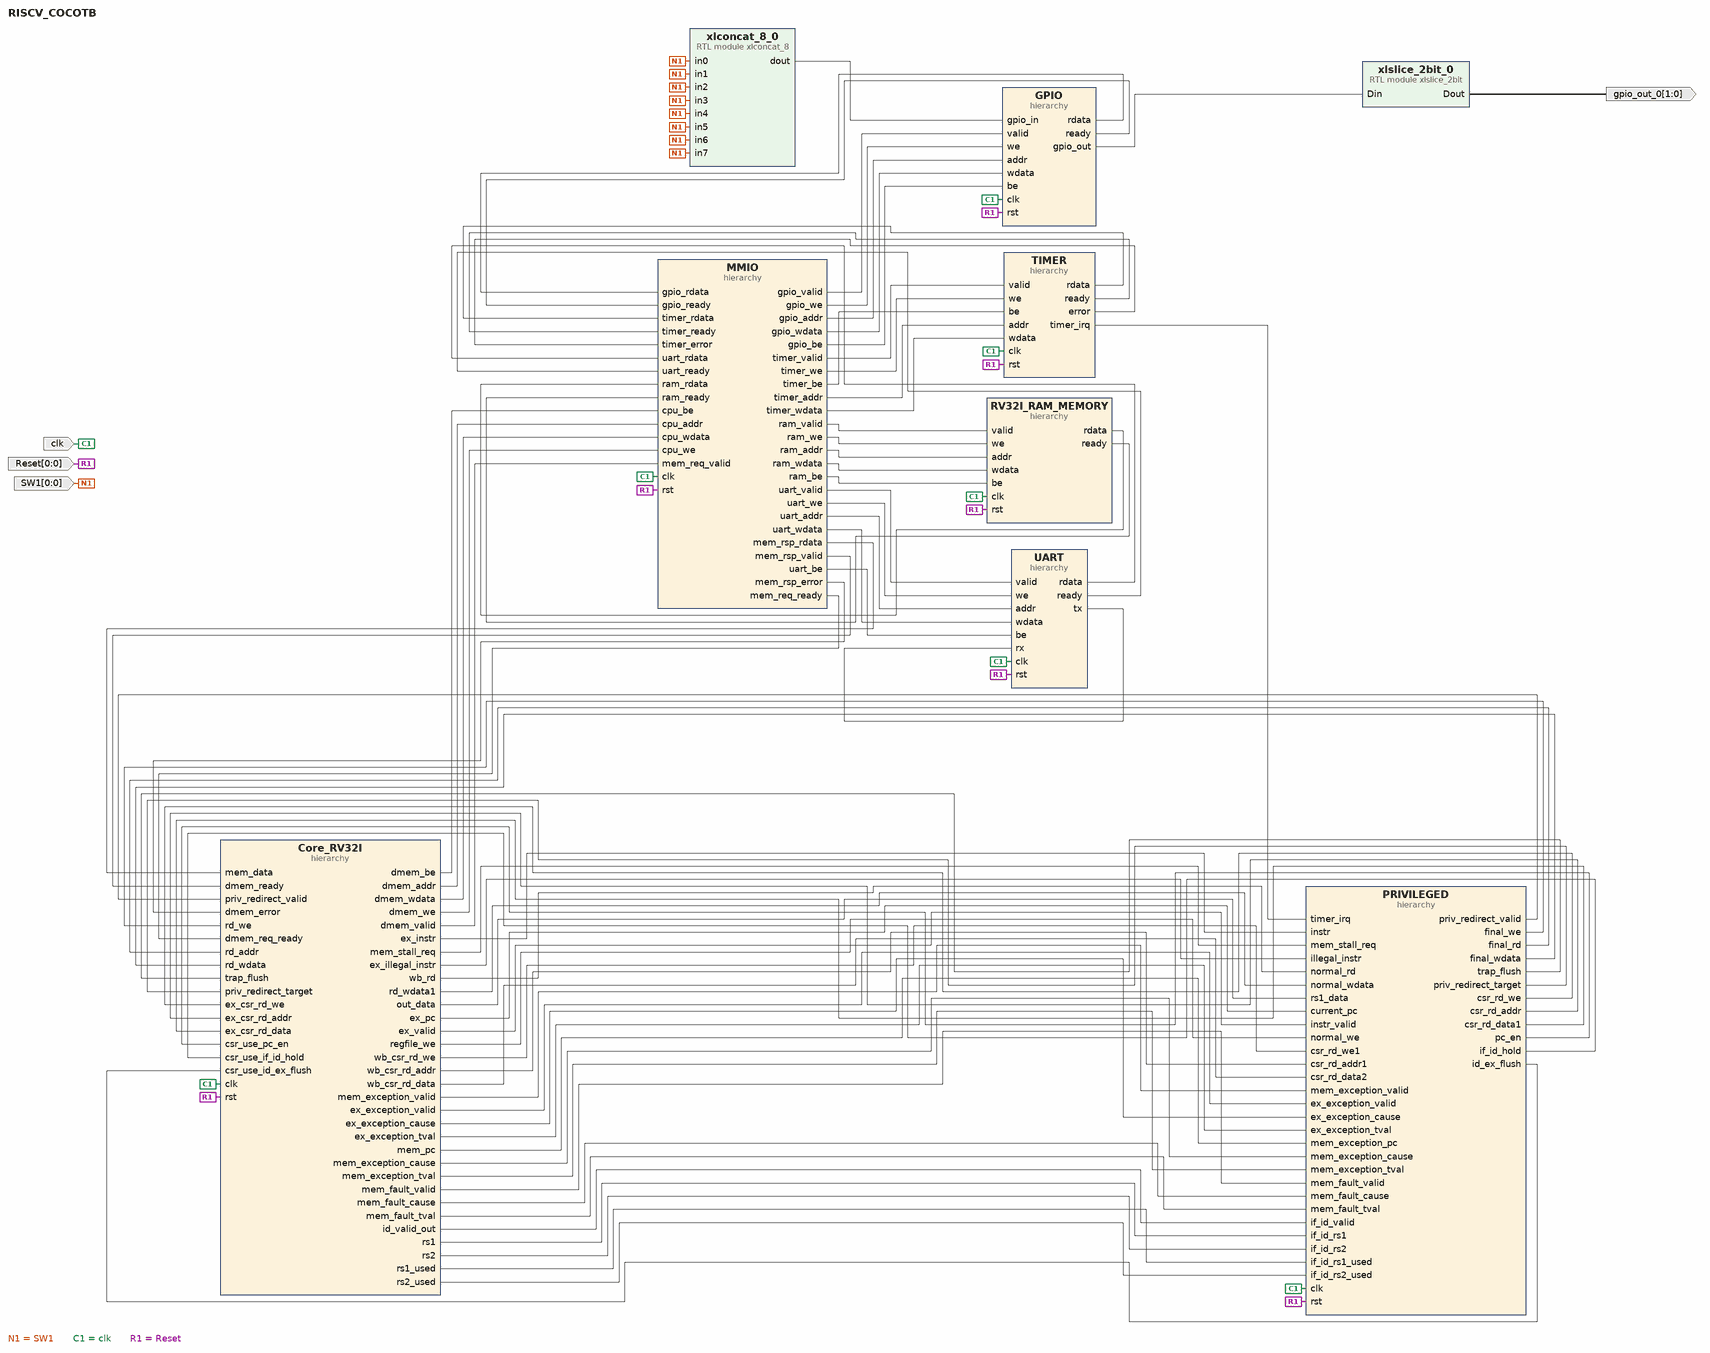
[diagram p0: block diagram of the top level]
# Vivado block design RISCV_COCOTB, xczu5ev-sfvc784-2-i, Vivado 2020.1
create_bd_design RISCV_COCOTB

create_bd_port -dir I -from 0 -to 0 SW1
create_bd_port -dir O -from 1 -to 0 gpio_out_0
create_bd_port -dir I -from 0 -to 0 Reset
create_bd_port -dir I clk

create_bd_cell -type hier UART
create_bd_cell -type hier TIMER
create_bd_cell -type hier Core_RV32I
create_bd_cell -type hier MMIO
create_bd_cell -type hier PRIVILEGED
create_bd_cell -type hier GPIO
create_bd_cell -type hier RV32I_RAM_MEMORY
create_bd_cell -type module -reference xlconcat_8 xlconcat_8_0
create_bd_cell -type module -reference xlslice_2bit xlslice_2bit_0

# ---- hierarchy /UART ----
current_bd_instance /UART
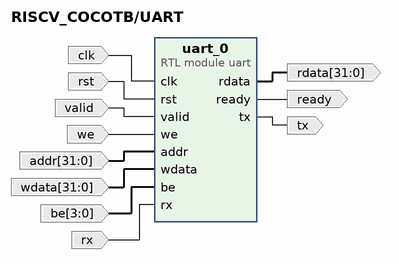
[diagram p1: block diagram inside /UART]
create_bd_pin -dir I -type clk clk
create_bd_pin -dir I -type rst rst
create_bd_pin -dir I valid
create_bd_pin -dir I we
create_bd_pin -dir I -from 31 -to 0 addr
create_bd_pin -dir I -from 31 -to 0 wdata
create_bd_pin -dir I -from 3 -to 0 be
create_bd_pin -dir O -from 31 -to 0 rdata
create_bd_pin -dir O ready
create_bd_pin -dir O tx
create_bd_pin -dir I rx

create_bd_cell -type module -reference uart uart_0

# ---- hierarchy /TIMER ----
current_bd_instance /TIMER
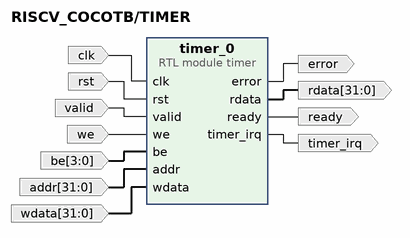
[diagram p2: block diagram inside /TIMER]
create_bd_pin -dir I -type clk clk
create_bd_pin -dir I -type rst rst
create_bd_pin -dir I valid
create_bd_pin -dir I we
create_bd_pin -dir I -from 3 -to 0 be
create_bd_pin -dir I -from 31 -to 0 addr
create_bd_pin -dir I -from 31 -to 0 wdata
create_bd_pin -dir O -from 31 -to 0 rdata
create_bd_pin -dir O ready
create_bd_pin -dir O -type intr timer_irq
create_bd_pin -dir O error

create_bd_cell -type module -reference timer timer_0
set_property -dict {CONFIG.RESET_CMP 0x0002E7CA} [get_bd_cells timer_0]

# ---- hierarchy /Core_RV32I ----
current_bd_instance /Core_RV32I
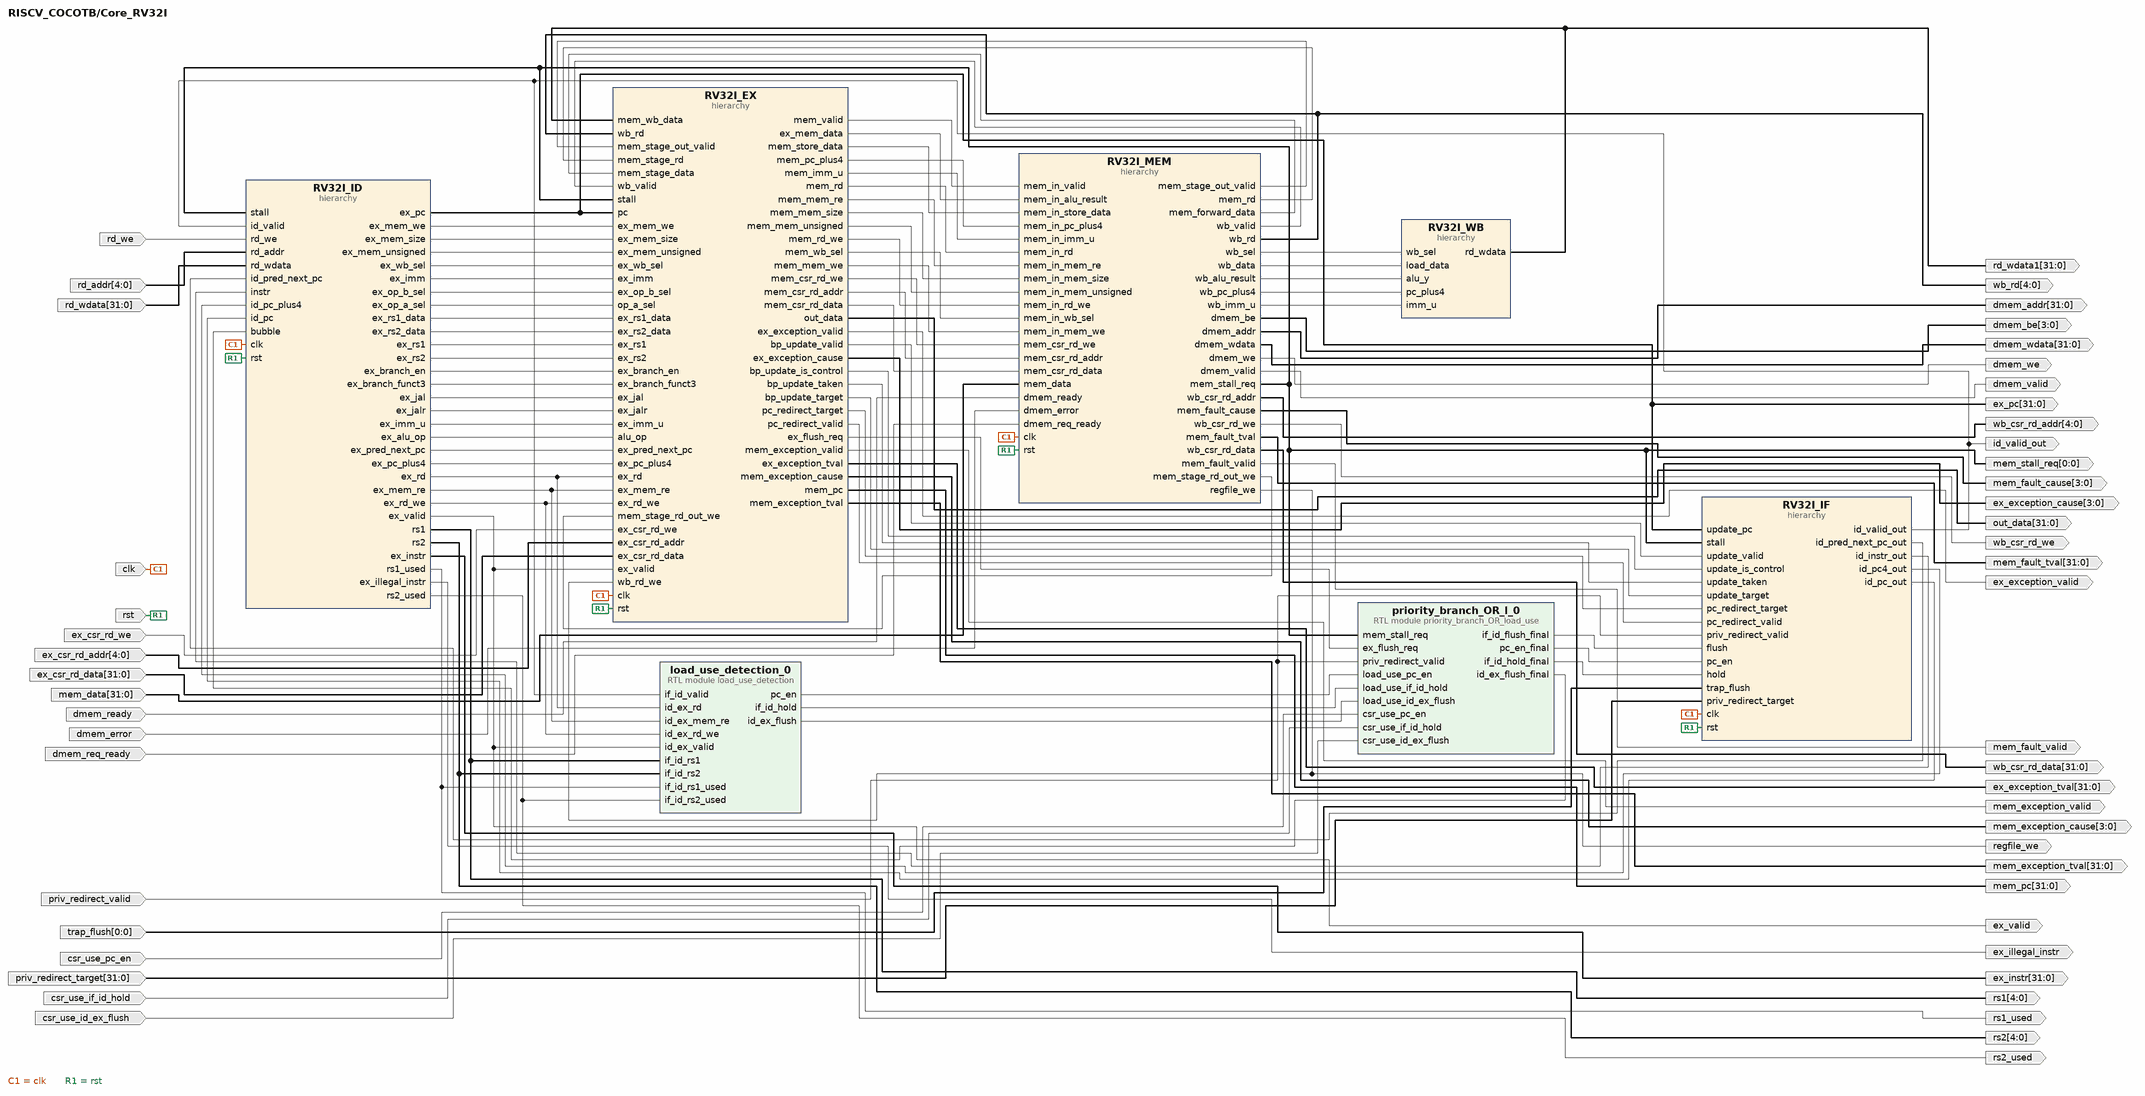
[diagram p3: block diagram inside /Core_RV32I]
create_bd_pin -dir I -type clk clk
create_bd_pin -dir I -type rst rst
create_bd_pin -dir I -from 31 -to 0 mem_data
create_bd_pin -dir O -from 3 -to 0 dmem_be
create_bd_pin -dir O -from 31 -to 0 dmem_addr
create_bd_pin -dir O -from 31 -to 0 dmem_wdata
create_bd_pin -dir O dmem_we
create_bd_pin -dir I dmem_ready
create_bd_pin -dir O -from 31 -to 0 ex_instr
create_bd_pin -dir O -from 0 -to 0 mem_stall_req
create_bd_pin -dir O ex_illegal_instr
create_bd_pin -dir I priv_redirect_valid
create_bd_pin -dir I rd_we
create_bd_pin -dir I -from 4 -to 0 rd_addr
create_bd_pin -dir I -from 31 -to 0 rd_wdata
create_bd_pin -dir O -from 4 -to 0 wb_rd
create_bd_pin -dir O -from 31 -to 0 rd_wdata1
create_bd_pin -dir O -from 31 -to 0 out_data
create_bd_pin -dir O -from 31 -to 0 ex_pc
create_bd_pin -dir O ex_valid
create_bd_pin -dir I -from 0 -to 0 trap_flush
create_bd_pin -dir I -from 31 -to 0 priv_redirect_target
create_bd_pin -dir I dmem_error
create_bd_pin -dir O regfile_we
create_bd_pin -dir O dmem_valid
create_bd_pin -dir I dmem_req_ready
create_bd_pin -dir I ex_csr_rd_we
create_bd_pin -dir I -from 4 -to 0 ex_csr_rd_addr
create_bd_pin -dir I -from 31 -to 0 ex_csr_rd_data
create_bd_pin -dir O wb_csr_rd_we
create_bd_pin -dir O -from 4 -to 0 wb_csr_rd_addr
create_bd_pin -dir O -from 31 -to 0 wb_csr_rd_data
create_bd_pin -dir O mem_exception_valid
create_bd_pin -dir O ex_exception_valid
create_bd_pin -dir O -from 3 -to 0 ex_exception_cause
create_bd_pin -dir O -from 31 -to 0 ex_exception_tval
create_bd_pin -dir O -from 31 -to 0 mem_pc
create_bd_pin -dir O -from 3 -to 0 mem_exception_cause
create_bd_pin -dir O -from 31 -to 0 mem_exception_tval
create_bd_pin -dir O mem_fault_valid
create_bd_pin -dir O -from 3 -to 0 mem_fault_cause
create_bd_pin -dir O -from 31 -to 0 mem_fault_tval
create_bd_pin -dir O id_valid_out
create_bd_pin -dir O -from 4 -to 0 rs1
create_bd_pin -dir O -from 4 -to 0 rs2
create_bd_pin -dir O rs1_used
create_bd_pin -dir O rs2_used
create_bd_pin -dir I csr_use_pc_en
create_bd_pin -dir I csr_use_if_id_hold
create_bd_pin -dir I csr_use_id_ex_flush

create_bd_cell -type hier RV32I_MEM
create_bd_cell -type hier RV32I_EX
create_bd_cell -type hier RV32I_WB
create_bd_cell -type hier RV32I_ID
create_bd_cell -type hier RV32I_IF
create_bd_cell -type module -reference load_use_detection load_use_detection_0
create_bd_cell -type module -reference priority_branch_OR_load_use priority_branch_OR_l_0

# ---- hierarchy /Core_RV32I/RV32I_MEM ----
current_bd_instance /Core_RV32I/RV32I_MEM
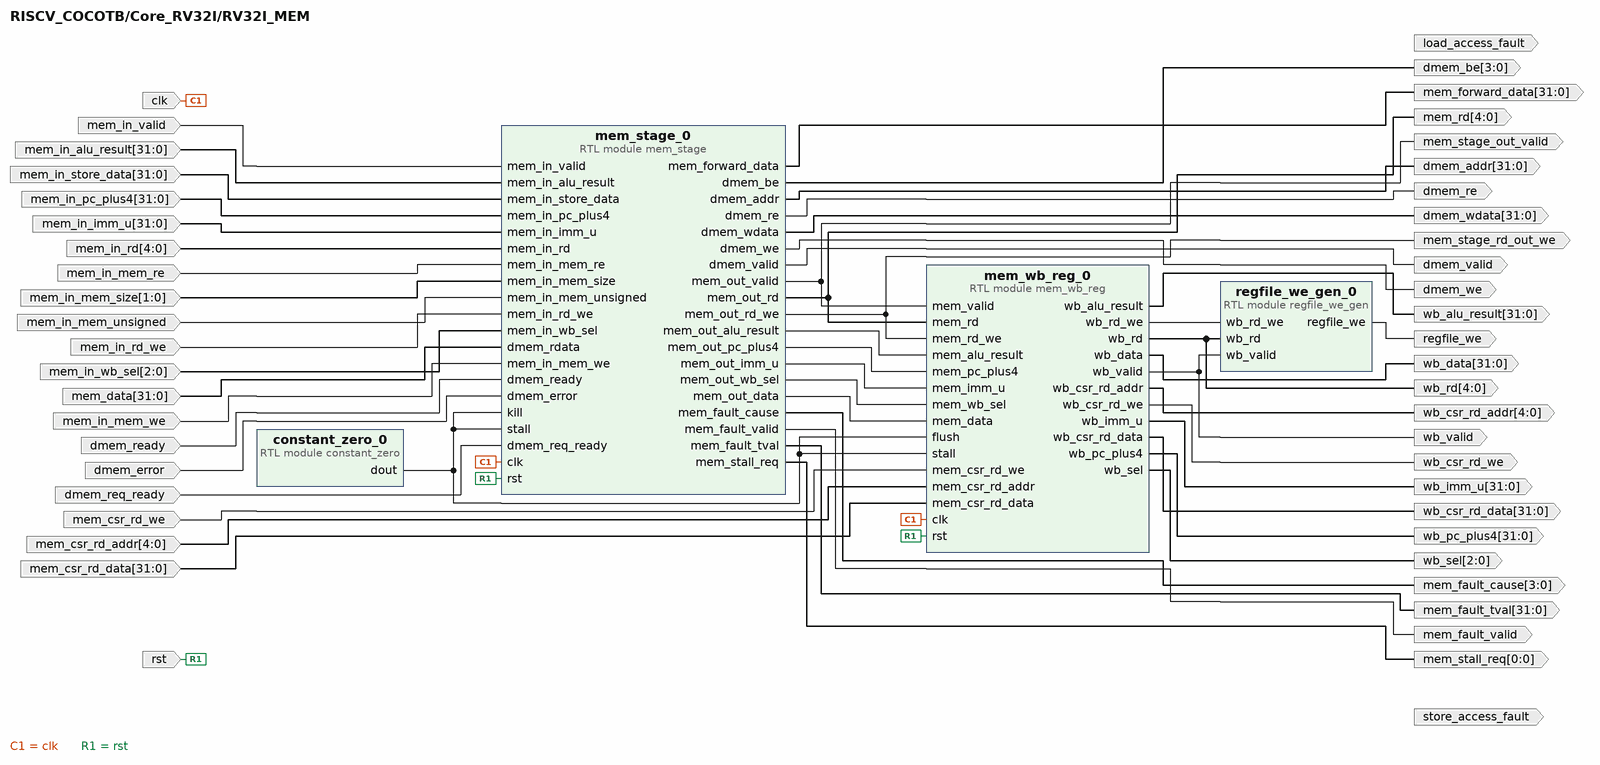
[diagram p4: block diagram inside /Core_RV32I/RV32I_MEM]
create_bd_pin -dir I -type clk clk
create_bd_pin -dir I -type rst rst
create_bd_pin -dir I mem_in_valid
create_bd_pin -dir I -from 31 -to 0 mem_in_alu_result
create_bd_pin -dir I -from 31 -to 0 mem_in_store_data
create_bd_pin -dir I -from 31 -to 0 mem_in_pc_plus4
create_bd_pin -dir I -from 31 -to 0 mem_in_imm_u
create_bd_pin -dir I -from 4 -to 0 mem_in_rd
create_bd_pin -dir I mem_in_mem_re
create_bd_pin -dir I mem_in_mem_we
create_bd_pin -dir I -from 1 -to 0 mem_in_mem_size
create_bd_pin -dir I mem_in_mem_unsigned
create_bd_pin -dir I mem_in_rd_we
create_bd_pin -dir I -from 2 -to 0 mem_in_wb_sel
create_bd_pin -dir O mem_stage_out_valid
create_bd_pin -dir O -from 4 -to 0 mem_rd
create_bd_pin -dir O mem_stage_rd_out_we
create_bd_pin -dir O -from 31 -to 0 mem_forward_data
create_bd_pin -dir O -from 31 -to 0 wb_data
create_bd_pin -dir O -from 31 -to 0 wb_alu_result
create_bd_pin -dir O -from 31 -to 0 wb_pc_plus4
create_bd_pin -dir O -from 31 -to 0 wb_imm_u
create_bd_pin -dir O -from 4 -to 0 wb_rd
create_bd_pin -dir O -from 2 -to 0 wb_sel
create_bd_pin -dir I -from 31 -to 0 mem_data
create_bd_pin -dir O -from 3 -to 0 dmem_be
create_bd_pin -dir O -from 31 -to 0 dmem_addr
create_bd_pin -dir O -from 31 -to 0 dmem_wdata
create_bd_pin -dir O dmem_we
create_bd_pin -dir O wb_valid
create_bd_pin -dir O dmem_re
create_bd_pin -dir I dmem_ready
create_bd_pin -dir O -from 0 -to 0 mem_stall_req
create_bd_pin -dir I dmem_error
create_bd_pin -dir O load_access_fault
create_bd_pin -dir O store_access_fault
create_bd_pin -dir O regfile_we
create_bd_pin -dir O dmem_valid
create_bd_pin -dir I dmem_req_ready
create_bd_pin -dir I mem_csr_rd_we
create_bd_pin -dir I -from 4 -to 0 mem_csr_rd_addr
create_bd_pin -dir I -from 31 -to 0 mem_csr_rd_data
create_bd_pin -dir O wb_csr_rd_we
create_bd_pin -dir O -from 4 -to 0 wb_csr_rd_addr
create_bd_pin -dir O -from 31 -to 0 wb_csr_rd_data
create_bd_pin -dir O mem_fault_valid
create_bd_pin -dir O -from 3 -to 0 mem_fault_cause
create_bd_pin -dir O -from 31 -to 0 mem_fault_tval

create_bd_cell -type module -reference regfile_we_gen regfile_we_gen_0
create_bd_cell -type module -reference mem_wb_reg mem_wb_reg_0
create_bd_cell -type module -reference constant_zero constant_zero_0
create_bd_cell -type module -reference mem_stage mem_stage_0

# ---- hierarchy /Core_RV32I/RV32I_EX ----
current_bd_instance /Core_RV32I/RV32I_EX
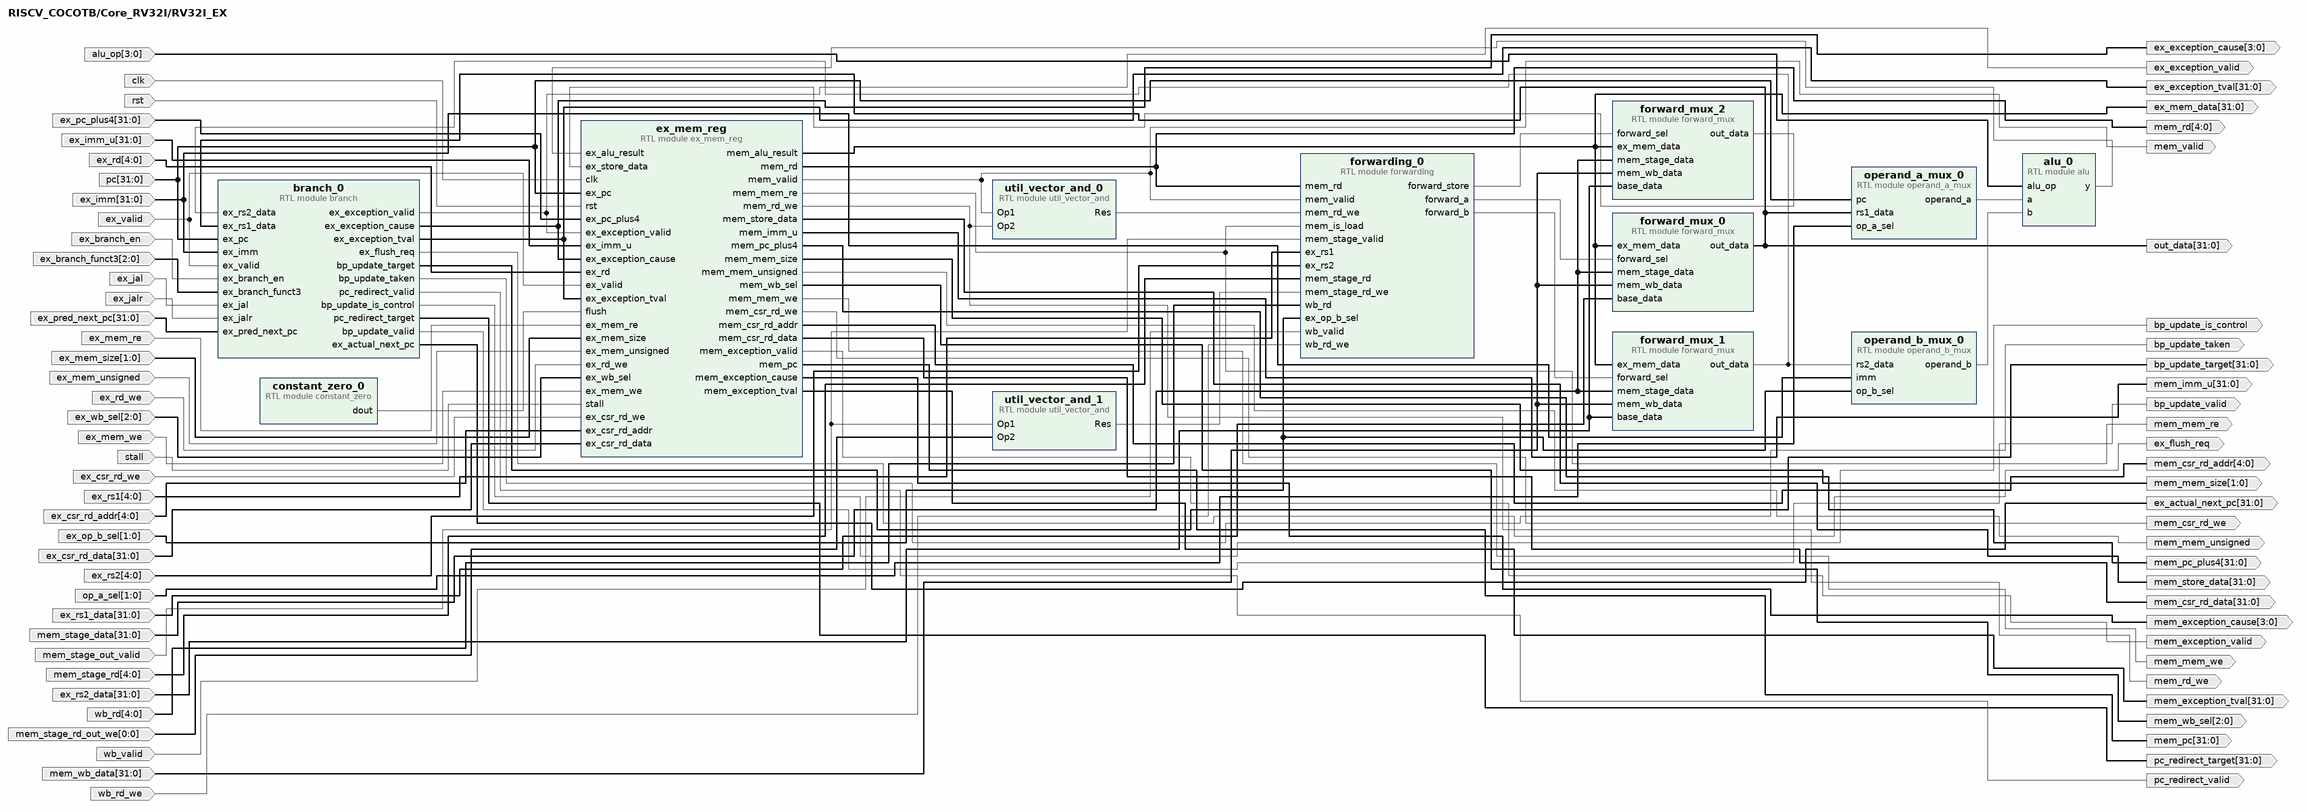
[diagram p5: block diagram inside /Core_RV32I/RV32I_EX]
create_bd_pin -dir I -from 3 -to 0 alu_op
create_bd_pin -dir I -type clk clk
create_bd_pin -dir I -type rst rst
create_bd_pin -dir I ex_valid
create_bd_pin -dir I -from 31 -to 0 pc
create_bd_pin -dir I -from 31 -to 0 ex_pc_plus4
create_bd_pin -dir I -from 31 -to 0 ex_imm_u
create_bd_pin -dir I -from 4 -to 0 ex_rd
create_bd_pin -dir I ex_mem_re
create_bd_pin -dir I ex_mem_we
create_bd_pin -dir I -from 1 -to 0 ex_mem_size
create_bd_pin -dir I ex_mem_unsigned
create_bd_pin -dir I ex_rd_we
create_bd_pin -dir I -from 2 -to 0 ex_wb_sel
create_bd_pin -dir O mem_valid
create_bd_pin -dir O -from 31 -to 0 ex_mem_data
create_bd_pin -dir O -from 31 -to 0 mem_store_data
create_bd_pin -dir O -from 31 -to 0 mem_pc_plus4
create_bd_pin -dir O -from 31 -to 0 mem_imm_u
create_bd_pin -dir O -from 4 -to 0 mem_rd
create_bd_pin -dir O mem_mem_re
create_bd_pin -dir O mem_mem_we
create_bd_pin -dir O -from 1 -to 0 mem_mem_size
create_bd_pin -dir O mem_mem_unsigned
create_bd_pin -dir O mem_rd_we
create_bd_pin -dir O -from 2 -to 0 mem_wb_sel
create_bd_pin -dir I -from 31 -to 0 ex_imm
create_bd_pin -dir I -from 1 -to 0 ex_op_b_sel
create_bd_pin -dir I -from 1 -to 0 op_a_sel
create_bd_pin -dir I -from 31 -to 0 ex_rs1_data
create_bd_pin -dir I -from 31 -to 0 mem_stage_data
create_bd_pin -dir I -from 31 -to 0 mem_wb_data
create_bd_pin -dir I -from 31 -to 0 ex_rs2_data
create_bd_pin -dir I -from 4 -to 0 ex_rs1
create_bd_pin -dir I -from 4 -to 0 ex_rs2
create_bd_pin -dir I -from 4 -to 0 mem_stage_rd
create_bd_pin -dir I -from 4 -to 0 wb_rd
create_bd_pin -dir I ex_branch_en
create_bd_pin -dir I -from 2 -to 0 ex_branch_funct3
create_bd_pin -dir I ex_jal
create_bd_pin -dir I ex_jalr
create_bd_pin -dir O pc_redirect_valid
create_bd_pin -dir O -from 31 -to 0 pc_redirect_target
create_bd_pin -dir O ex_flush_req
create_bd_pin -dir I mem_stage_out_valid
create_bd_pin -dir I wb_valid
create_bd_pin -dir I -from 31 -to 0 ex_pred_next_pc
create_bd_pin -dir O -from 31 -to 0 bp_update_target
create_bd_pin -dir O bp_update_taken
create_bd_pin -dir O bp_update_is_control
create_bd_pin -dir O bp_update_valid
create_bd_pin -dir O -from 31 -to 0 ex_actual_next_pc
create_bd_pin -dir I stall
create_bd_pin -dir O -from 31 -to 0 out_data
create_bd_pin -dir I -from 0 -to 0 mem_stage_rd_out_we
create_bd_pin -dir I wb_rd_we
create_bd_pin -dir I ex_csr_rd_we
create_bd_pin -dir I -from 4 -to 0 ex_csr_rd_addr
create_bd_pin -dir I -from 31 -to 0 ex_csr_rd_data
create_bd_pin -dir O mem_csr_rd_we
create_bd_pin -dir O -from 4 -to 0 mem_csr_rd_addr
create_bd_pin -dir O -from 31 -to 0 mem_csr_rd_data
create_bd_pin -dir O mem_exception_valid
create_bd_pin -dir O ex_exception_valid
create_bd_pin -dir O -from 3 -to 0 ex_exception_cause
create_bd_pin -dir O -from 31 -to 0 ex_exception_tval
create_bd_pin -dir O -from 31 -to 0 mem_pc
create_bd_pin -dir O -from 3 -to 0 mem_exception_cause
create_bd_pin -dir O -from 31 -to 0 mem_exception_tval

create_bd_cell -type module -reference alu alu_0
create_bd_cell -type module -reference operand_b_mux operand_b_mux_0
create_bd_cell -type module -reference operand_a_mux operand_a_mux_0
create_bd_cell -type module -reference branch branch_0
create_bd_cell -type module -reference ex_mem_reg ex_mem_reg
create_bd_cell -type module -reference util_vector_and util_vector_and_0
create_bd_cell -type module -reference util_vector_and util_vector_and_1
create_bd_cell -type module -reference forward_mux forward_mux_0
create_bd_cell -type module -reference forward_mux forward_mux_1
create_bd_cell -type module -reference forward_mux forward_mux_2
create_bd_cell -type module -reference forwarding forwarding_0
create_bd_cell -type module -reference constant_zero constant_zero_0

# ---- hierarchy /Core_RV32I/RV32I_WB ----
current_bd_instance /Core_RV32I/RV32I_WB
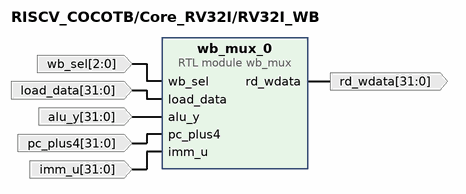
[diagram p6: block diagram inside /Core_RV32I/RV32I_WB]
create_bd_pin -dir O -from 31 -to 0 rd_wdata
create_bd_pin -dir I -from 2 -to 0 wb_sel
create_bd_pin -dir I -from 31 -to 0 load_data
create_bd_pin -dir I -from 31 -to 0 alu_y
create_bd_pin -dir I -from 31 -to 0 pc_plus4
create_bd_pin -dir I -from 31 -to 0 imm_u

create_bd_cell -type module -reference wb_mux wb_mux_0

# ---- hierarchy /Core_RV32I/RV32I_ID ----
current_bd_instance /Core_RV32I/RV32I_ID
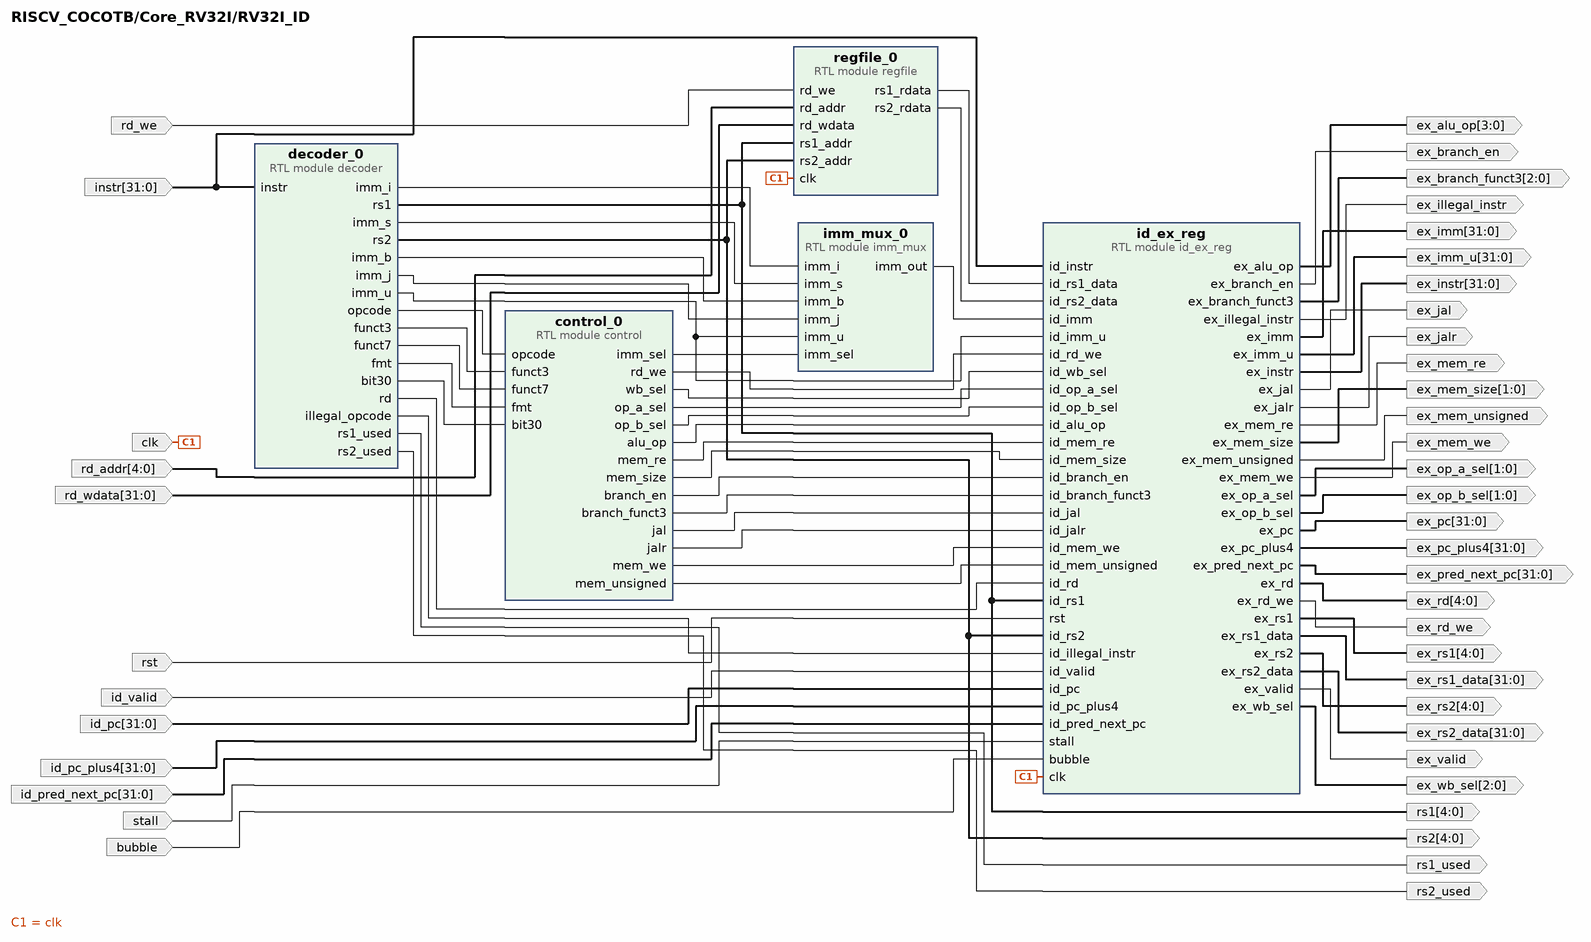
[diagram p7: block diagram inside /Core_RV32I/RV32I_ID]
create_bd_pin -dir I -type clk clk
create_bd_pin -dir I -from 31 -to 0 instr
create_bd_pin -dir I -type rst rst
create_bd_pin -dir I bubble
create_bd_pin -dir I id_valid
create_bd_pin -dir I -from 31 -to 0 id_pc
create_bd_pin -dir I -from 31 -to 0 id_pc_plus4
create_bd_pin -dir O ex_valid
create_bd_pin -dir O -from 31 -to 0 ex_pc
create_bd_pin -dir O -from 31 -to 0 ex_pc_plus4
create_bd_pin -dir O -from 31 -to 0 ex_rs1_data
create_bd_pin -dir O -from 31 -to 0 ex_rs2_data
create_bd_pin -dir O -from 31 -to 0 ex_imm
create_bd_pin -dir O -from 31 -to 0 ex_imm_u
create_bd_pin -dir O -from 4 -to 0 ex_rs1
create_bd_pin -dir O -from 4 -to 0 ex_rs2
create_bd_pin -dir O -from 4 -to 0 ex_rd
create_bd_pin -dir O -from 3 -to 0 ex_alu_op
create_bd_pin -dir O -from 1 -to 0 ex_op_a_sel
create_bd_pin -dir O -from 1 -to 0 ex_op_b_sel
create_bd_pin -dir O ex_branch_en
create_bd_pin -dir O -from 2 -to 0 ex_branch_funct3
create_bd_pin -dir O ex_jal
create_bd_pin -dir O ex_jalr
create_bd_pin -dir O ex_mem_re
create_bd_pin -dir O ex_mem_we
create_bd_pin -dir O -from 1 -to 0 ex_mem_size
create_bd_pin -dir O ex_mem_unsigned
create_bd_pin -dir O ex_rd_we
create_bd_pin -dir O -from 2 -to 0 ex_wb_sel
create_bd_pin -dir O -from 4 -to 0 rs1
create_bd_pin -dir O -from 4 -to 0 rs2
create_bd_pin -dir O rs1_used
create_bd_pin -dir O rs2_used
create_bd_pin -dir I -from 31 -to 0 id_pred_next_pc
create_bd_pin -dir O -from 31 -to 0 ex_pred_next_pc
create_bd_pin -dir I stall
create_bd_pin -dir O -from 31 -to 0 ex_instr
create_bd_pin -dir O ex_illegal_instr
create_bd_pin -dir I rd_we
create_bd_pin -dir I -from 4 -to 0 rd_addr
create_bd_pin -dir I -from 31 -to 0 rd_wdata

create_bd_cell -type module -reference imm_mux imm_mux_0
create_bd_cell -type module -reference decoder decoder_0
create_bd_cell -type module -reference control control_0
create_bd_cell -type module -reference id_ex_reg id_ex_reg
create_bd_cell -type module -reference regfile regfile_0

# ---- hierarchy /Core_RV32I/RV32I_IF ----
current_bd_instance /Core_RV32I/RV32I_IF
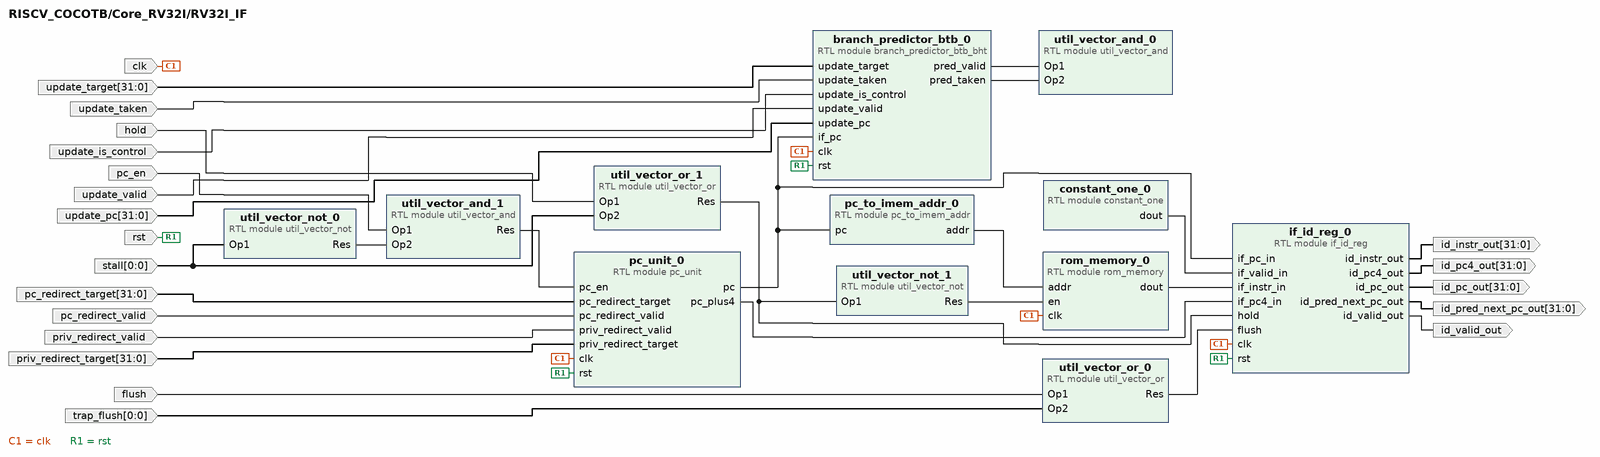
[diagram p8: block diagram inside /Core_RV32I/RV32I_IF]
create_bd_pin -dir I -type clk clk
create_bd_pin -dir I -type rst rst
create_bd_pin -dir I pc_redirect_valid
create_bd_pin -dir I -from 31 -to 0 pc_redirect_target
create_bd_pin -dir I flush
create_bd_pin -dir O -from 31 -to 0 id_pc_out
create_bd_pin -dir O -from 31 -to 0 id_pc4_out
create_bd_pin -dir O -from 31 -to 0 id_instr_out
create_bd_pin -dir O id_valid_out
create_bd_pin -dir I pc_en
create_bd_pin -dir I hold
create_bd_pin -dir I -from 31 -to 0 update_pc
create_bd_pin -dir O -from 31 -to 0 id_pred_next_pc_out
create_bd_pin -dir I -from 31 -to 0 update_target
create_bd_pin -dir I update_taken
create_bd_pin -dir I update_is_control
create_bd_pin -dir I update_valid
create_bd_pin -dir I -from 0 -to 0 stall
create_bd_pin -dir I priv_redirect_valid
create_bd_pin -dir I -from 31 -to 0 priv_redirect_target
create_bd_pin -dir I -from 0 -to 0 trap_flush

create_bd_cell -type module -reference branch_predictor_btb_bht branch_predictor_btb_0
create_bd_cell -type module -reference pc_to_imem_addr pc_to_imem_addr_0
set_property -dict {CONFIG.ADDR_W 11} [get_bd_cells pc_to_imem_addr_0]
create_bd_cell -type module -reference util_vector_and util_vector_and_1
create_bd_cell -type module -reference util_vector_or util_vector_or_1
create_bd_cell -type module -reference util_vector_not util_vector_not_1
create_bd_cell -type module -reference util_vector_and util_vector_and_0
create_bd_cell -type module -reference util_vector_not util_vector_not_0
create_bd_cell -type module -reference util_vector_or util_vector_or_0
create_bd_cell -type module -reference constant_one constant_one_0
create_bd_cell -type module -reference pc_unit pc_unit_0
set_property -dict {CONFIG.RESET_PC 0x80000000} [get_bd_cells pc_unit_0]
create_bd_cell -type module -reference if_id_reg if_id_reg_0
create_bd_cell -type module -reference rom_memory rom_memory_0
set_property -dict [list \
  CONFIG.INIT_FILE /media/steckler/xilinx_linux/RISCV_ZYNQ/V2/RVI20U32/rv32i_vscode/prog_asm.mem \
] [get_bd_cells rom_memory_0]

# ---- hierarchy /MMIO ----
current_bd_instance /MMIO
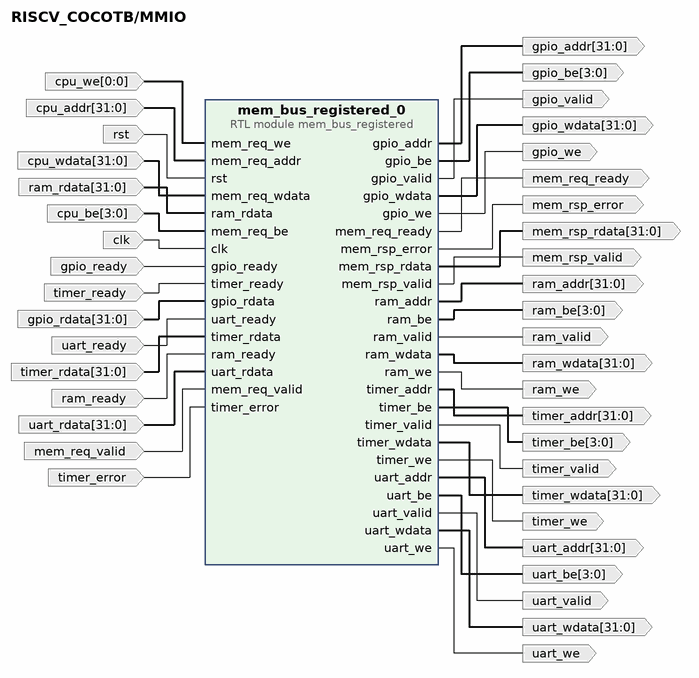
[diagram p9: block diagram inside /MMIO]
create_bd_pin -dir I -type clk clk
create_bd_pin -dir I -type rst rst
create_bd_pin -dir I -from 0 -to 0 cpu_we
create_bd_pin -dir I -from 31 -to 0 cpu_addr
create_bd_pin -dir I -from 31 -to 0 cpu_wdata
create_bd_pin -dir I -from 3 -to 0 cpu_be
create_bd_pin -dir I -from 31 -to 0 ram_rdata
create_bd_pin -dir I -from 31 -to 0 gpio_rdata
create_bd_pin -dir I gpio_ready
create_bd_pin -dir I uart_ready
create_bd_pin -dir I -from 31 -to 0 uart_rdata
create_bd_pin -dir I -from 31 -to 0 timer_rdata
create_bd_pin -dir I timer_ready
create_bd_pin -dir O -from 31 -to 0 mem_rsp_rdata
create_bd_pin -dir O ram_valid
create_bd_pin -dir O ram_we
create_bd_pin -dir O -from 31 -to 0 ram_addr
create_bd_pin -dir O -from 31 -to 0 ram_wdata
create_bd_pin -dir O -from 3 -to 0 ram_be
create_bd_pin -dir O gpio_valid
create_bd_pin -dir O gpio_we
create_bd_pin -dir O -from 31 -to 0 gpio_addr
create_bd_pin -dir O -from 31 -to 0 gpio_wdata
create_bd_pin -dir O -from 3 -to 0 gpio_be
create_bd_pin -dir O uart_valid
create_bd_pin -dir O uart_we
create_bd_pin -dir O -from 31 -to 0 uart_addr
create_bd_pin -dir O -from 31 -to 0 uart_wdata
create_bd_pin -dir O -from 3 -to 0 uart_be
create_bd_pin -dir O timer_valid
create_bd_pin -dir O timer_we
create_bd_pin -dir O -from 31 -to 0 timer_addr
create_bd_pin -dir O -from 31 -to 0 timer_wdata
create_bd_pin -dir O -from 3 -to 0 timer_be
create_bd_pin -dir I ram_ready
create_bd_pin -dir O mem_rsp_valid
create_bd_pin -dir O mem_rsp_error
create_bd_pin -dir I mem_req_valid
create_bd_pin -dir O mem_req_ready
create_bd_pin -dir I timer_error

create_bd_cell -type module -reference mem_bus_registered mem_bus_registered_0

# ---- hierarchy /PRIVILEGED ----
current_bd_instance /PRIVILEGED
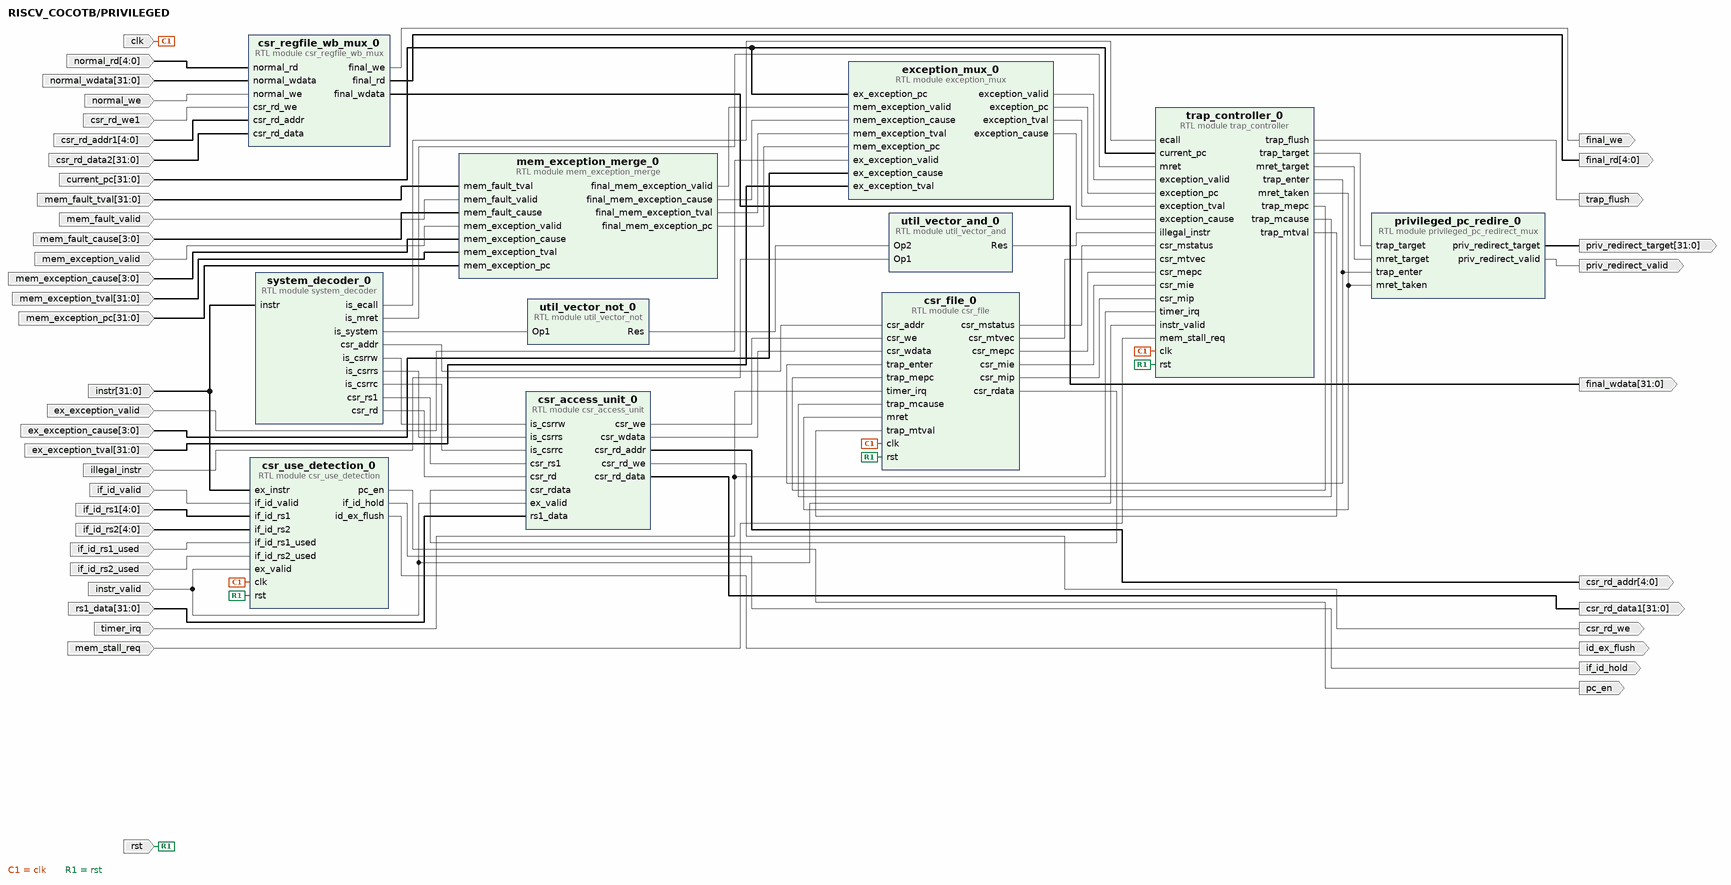
[diagram p10: block diagram inside /PRIVILEGED]
create_bd_pin -dir I -from 31 -to 0 instr
create_bd_pin -dir I instr_valid
create_bd_pin -dir I -type clk clk
create_bd_pin -dir I -type rst rst
create_bd_pin -dir I -from 31 -to 0 current_pc
create_bd_pin -dir I illegal_instr
create_bd_pin -dir I -type intr timer_irq
create_bd_pin -dir I mem_stall_req
create_bd_pin -dir O trap_flush
create_bd_pin -dir I -from 4 -to 0 normal_rd
create_bd_pin -dir I -from 31 -to 0 normal_wdata
create_bd_pin -dir O final_we
create_bd_pin -dir O -from 4 -to 0 final_rd
create_bd_pin -dir O -from 31 -to 0 final_wdata
create_bd_pin -dir O priv_redirect_valid
create_bd_pin -dir O -from 31 -to 0 priv_redirect_target
create_bd_pin -dir I -from 31 -to 0 rs1_data
create_bd_pin -dir I normal_we
create_bd_pin -dir O csr_rd_we
create_bd_pin -dir O -from 4 -to 0 csr_rd_addr
create_bd_pin -dir O -from 31 -to 0 csr_rd_data1
create_bd_pin -dir I csr_rd_we1
create_bd_pin -dir I -from 4 -to 0 csr_rd_addr1
create_bd_pin -dir I -from 31 -to 0 csr_rd_data2
create_bd_pin -dir I ex_exception_valid
create_bd_pin -dir I -from 3 -to 0 ex_exception_cause
create_bd_pin -dir I -from 31 -to 0 ex_exception_tval
create_bd_pin -dir I -from 31 -to 0 mem_fault_tval
create_bd_pin -dir I mem_fault_valid
create_bd_pin -dir I -from 3 -to 0 mem_fault_cause
create_bd_pin -dir I mem_exception_valid
create_bd_pin -dir I -from 3 -to 0 mem_exception_cause
create_bd_pin -dir I -from 31 -to 0 mem_exception_tval
create_bd_pin -dir I -from 31 -to 0 mem_exception_pc
create_bd_pin -dir I if_id_valid
create_bd_pin -dir I -from 4 -to 0 if_id_rs1
create_bd_pin -dir I -from 4 -to 0 if_id_rs2
create_bd_pin -dir I if_id_rs1_used
create_bd_pin -dir I if_id_rs2_used
create_bd_pin -dir O pc_en
create_bd_pin -dir O if_id_hold
create_bd_pin -dir O id_ex_flush

create_bd_cell -type module -reference csr_access_unit csr_access_unit_0
create_bd_cell -type module -reference privileged_pc_redirect_mux privileged_pc_redire_0
create_bd_cell -type module -reference system_decoder system_decoder_0
create_bd_cell -type module -reference trap_controller trap_controller_0
create_bd_cell -type module -reference exception_mux exception_mux_0
create_bd_cell -type module -reference mem_exception_merge mem_exception_merge_0
create_bd_cell -type module -reference util_vector_and util_vector_and_0
create_bd_cell -type module -reference util_vector_not util_vector_not_0
create_bd_cell -type module -reference csr_file csr_file_0
create_bd_cell -type module -reference csr_use_detection csr_use_detection_0
create_bd_cell -type module -reference csr_regfile_wb_mux csr_regfile_wb_mux_0

# ---- hierarchy /GPIO ----
current_bd_instance /GPIO
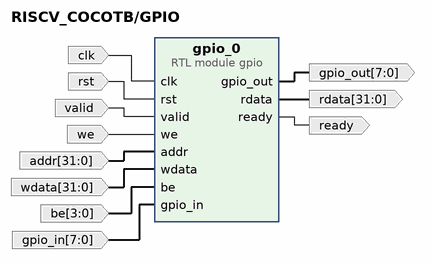
[diagram p11: block diagram inside /GPIO]
create_bd_pin -dir I -type clk clk
create_bd_pin -dir I -type rst rst
create_bd_pin -dir I valid
create_bd_pin -dir I we
create_bd_pin -dir I -from 31 -to 0 addr
create_bd_pin -dir I -from 31 -to 0 wdata
create_bd_pin -dir I -from 3 -to 0 be
create_bd_pin -dir O -from 31 -to 0 rdata
create_bd_pin -dir O ready
create_bd_pin -dir O -from 7 -to 0 gpio_out
create_bd_pin -dir I -from 7 -to 0 gpio_in

create_bd_cell -type module -reference gpio gpio_0

# ---- hierarchy /RV32I_RAM_MEMORY ----
current_bd_instance /RV32I_RAM_MEMORY
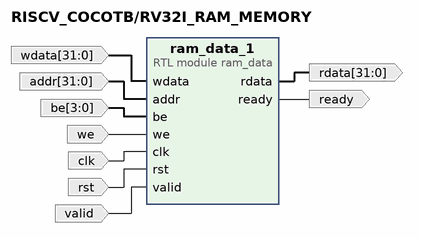
[diagram p12: block diagram inside /RV32I_RAM_MEMORY]
create_bd_pin -dir O -from 31 -to 0 rdata
create_bd_pin -dir I -from 31 -to 0 wdata
create_bd_pin -dir I -from 31 -to 0 addr
create_bd_pin -dir I -from 3 -to 0 be
create_bd_pin -dir I we
create_bd_pin -dir I -type clk clk
create_bd_pin -dir I -type rst rst
create_bd_pin -dir O ready
create_bd_pin -dir I valid

create_bd_cell -type module -reference ram_data ram_data_1

# ---- connections ----

current_bd_instance /UART
connect_bd_net -net zynq_ultra_ps_e_0_pl_clk0 [get_bd_pins clk] [get_bd_pins uart_0/clk]
connect_bd_net -net proc_sys_reset_0_peripheral_reset [get_bd_pins rst] [get_bd_pins uart_0/rst]
connect_bd_net -net MMIO_uart_valid [get_bd_pins valid] [get_bd_pins uart_0/valid]
connect_bd_net -net MMIO_uart_we [get_bd_pins we] [get_bd_pins uart_0/we]
connect_bd_net -net MMIO_uart_addr [get_bd_pins addr] [get_bd_pins uart_0/addr]
connect_bd_net -net MMIO_uart_wdata [get_bd_pins wdata] [get_bd_pins uart_0/wdata]
connect_bd_net -net MMIO_uart_be [get_bd_pins be] [get_bd_pins uart_0/be]
connect_bd_net [get_bd_pins rx] [get_bd_pins uart_0/rx]
connect_bd_net [get_bd_pins uart_0/rdata] [get_bd_pins rdata]
connect_bd_net [get_bd_pins uart_0/ready] [get_bd_pins ready]
connect_bd_net [get_bd_pins uart_0/tx] [get_bd_pins tx]

current_bd_instance /TIMER
connect_bd_net -net zynq_ultra_ps_e_0_pl_clk0 [get_bd_pins clk] [get_bd_pins timer_0/clk]
connect_bd_net -net proc_sys_reset_0_peripheral_reset [get_bd_pins rst] [get_bd_pins timer_0/rst]
connect_bd_net -net MMIO_timer_valid [get_bd_pins valid] [get_bd_pins timer_0/valid]
connect_bd_net -net MMIO_timer_we [get_bd_pins we] [get_bd_pins timer_0/we]
connect_bd_net -net MMIO_timer_be [get_bd_pins be] [get_bd_pins timer_0/be]
connect_bd_net -net MMIO_timer_addr [get_bd_pins addr] [get_bd_pins timer_0/addr]
connect_bd_net -net MMIO_timer_wdata [get_bd_pins wdata] [get_bd_pins timer_0/wdata]
connect_bd_net [get_bd_pins timer_0/rdata] [get_bd_pins rdata]
connect_bd_net [get_bd_pins timer_0/ready] [get_bd_pins ready]
connect_bd_net [get_bd_pins timer_0/timer_irq] [get_bd_pins timer_irq]
connect_bd_net [get_bd_pins timer_0/error] [get_bd_pins error]

current_bd_instance /Core_RV32I
connect_bd_net -net mem_wb_reg_0_wb_rd [get_bd_pins RV32I_MEM/wb_rd] [get_bd_pins RV32I_EX/wb_rd] [get_bd_pins wb_rd]
connect_bd_net -net wb_mux_0_rd_wdata [get_bd_pins RV32I_WB/rd_wdata] [get_bd_pins RV32I_EX/mem_wb_data] [get_bd_pins rd_wdata1]
connect_bd_net -net ex_mem_reg_1_mem_valid [get_bd_pins RV32I_EX/mem_valid] [get_bd_pins RV32I_MEM/mem_in_valid]
connect_bd_net -net ex_mem_reg_1_mem_alu_result [get_bd_pins RV32I_EX/ex_mem_data] [get_bd_pins RV32I_MEM/mem_in_alu_result]
connect_bd_net -net ex_mem_reg_1_mem_store_data [get_bd_pins RV32I_EX/mem_store_data] [get_bd_pins RV32I_MEM/mem_in_store_data]
connect_bd_net -net ex_mem_reg_1_mem_pc_plus4 [get_bd_pins RV32I_EX/mem_pc_plus4] [get_bd_pins RV32I_MEM/mem_in_pc_plus4]
connect_bd_net -net ex_mem_reg_1_mem_imm_u [get_bd_pins RV32I_EX/mem_imm_u] [get_bd_pins RV32I_MEM/mem_in_imm_u]
connect_bd_net -net ex_mem_reg_1_mem_rd [get_bd_pins RV32I_EX/mem_rd] [get_bd_pins RV32I_MEM/mem_in_rd]
connect_bd_net -net ex_mem_reg_1_mem_mem_re [get_bd_pins RV32I_EX/mem_mem_re] [get_bd_pins RV32I_MEM/mem_in_mem_re]
connect_bd_net -net ex_mem_reg_1_mem_mem_size [get_bd_pins RV32I_EX/mem_mem_size] [get_bd_pins RV32I_MEM/mem_in_mem_size]
connect_bd_net -net ex_mem_reg_1_mem_mem_unsigned [get_bd_pins RV32I_EX/mem_mem_unsigned] [get_bd_pins RV32I_MEM/mem_in_mem_unsigned]
connect_bd_net -net ex_mem_reg_1_mem_rd_we [get_bd_pins RV32I_EX/mem_rd_we] [get_bd_pins RV32I_MEM/mem_in_rd_we]
connect_bd_net -net ex_mem_reg_1_mem_wb_sel [get_bd_pins RV32I_EX/mem_wb_sel] [get_bd_pins RV32I_MEM/mem_in_wb_sel]
connect_bd_net -net mem_stage_0_mem_out_valid [get_bd_pins RV32I_MEM/mem_stage_out_valid] [get_bd_pins RV32I_EX/mem_stage_out_valid]
connect_bd_net -net mem_stage_0_mem_out_rd [get_bd_pins RV32I_MEM/mem_rd] [get_bd_pins RV32I_EX/mem_stage_rd]
connect_bd_net -net mem_stage_0_mem_forward_data [get_bd_pins RV32I_MEM/mem_forward_data] [get_bd_pins RV32I_EX/mem_stage_data]
connect_bd_net [get_bd_pins RV32I_MEM/wb_valid] [get_bd_pins RV32I_EX/wb_valid]
connect_bd_net -net zynq_ultra_ps_e_0_pl_clk0 [get_bd_pins clk] \
  [get_bd_pins RV32I_EX/clk] [get_bd_pins RV32I_MEM/clk] [get_bd_pins RV32I_ID/clk] [get_bd_pins RV32I_IF/clk]
connect_bd_net -net proc_sys_reset_0_peripheral_reset [get_bd_pins rst] \
  [get_bd_pins RV32I_EX/rst] [get_bd_pins RV32I_MEM/rst] [get_bd_pins RV32I_ID/rst] [get_bd_pins RV32I_IF/rst]
connect_bd_net -net mmio_0_cpu_rdata [get_bd_pins mem_data] [get_bd_pins RV32I_MEM/mem_data]
connect_bd_net [get_bd_pins RV32I_MEM/dmem_be] [get_bd_pins dmem_be]
connect_bd_net [get_bd_pins RV32I_MEM/dmem_addr] [get_bd_pins dmem_addr]
connect_bd_net [get_bd_pins RV32I_MEM/dmem_wdata] [get_bd_pins dmem_wdata]
connect_bd_net [get_bd_pins RV32I_MEM/dmem_we] [get_bd_pins dmem_we]
connect_bd_net -net ex_mem_reg_1_mem_mem_we [get_bd_pins RV32I_EX/mem_mem_we] [get_bd_pins RV32I_MEM/mem_in_mem_we]
connect_bd_net [get_bd_pins RV32I_IF/id_valid_out] \
  [get_bd_pins RV32I_ID/id_valid] [get_bd_pins load_use_detection_0/if_id_valid] [get_bd_pins id_valid_out]
connect_bd_net [get_bd_pins RV32I_ID/ex_rd] [get_bd_pins RV32I_EX/ex_rd] [get_bd_pins load_use_detection_0/id_ex_rd]
connect_bd_net -net ex_mem_we_1 [get_bd_pins RV32I_ID/ex_mem_we] [get_bd_pins RV32I_EX/ex_mem_we]
connect_bd_net -net ex_mem_re_1 [get_bd_pins RV32I_ID/ex_mem_re] [get_bd_pins RV32I_EX/ex_mem_re] [get_bd_pins load_use_detection_0/id_ex_mem_re]
connect_bd_net -net pc_1 [get_bd_pins RV32I_ID/ex_pc] [get_bd_pins RV32I_EX/pc] [get_bd_pins ex_pc] [get_bd_pins RV32I_IF/update_pc]
connect_bd_net -net ex_mem_size_1 [get_bd_pins RV32I_ID/ex_mem_size] [get_bd_pins RV32I_EX/ex_mem_size]
connect_bd_net -net ex_mem_unsigned_1 [get_bd_pins RV32I_ID/ex_mem_unsigned] [get_bd_pins RV32I_EX/ex_mem_unsigned]
connect_bd_net -net ex_rd_we_1 [get_bd_pins RV32I_ID/ex_rd_we] [get_bd_pins RV32I_EX/ex_rd_we] [get_bd_pins load_use_detection_0/id_ex_rd_we]
connect_bd_net -net ex_wb_sel_1 [get_bd_pins RV32I_ID/ex_wb_sel] [get_bd_pins RV32I_EX/ex_wb_sel]
connect_bd_net -net ex_imm_1 [get_bd_pins RV32I_ID/ex_imm] [get_bd_pins RV32I_EX/ex_imm]
connect_bd_net -net ex_op_b_sel_1 [get_bd_pins RV32I_ID/ex_op_b_sel] [get_bd_pins RV32I_EX/ex_op_b_sel]
connect_bd_net -net op_a_sel_1 [get_bd_pins RV32I_ID/ex_op_a_sel] [get_bd_pins RV32I_EX/op_a_sel]
connect_bd_net -net ex_rs1_data_1 [get_bd_pins RV32I_ID/ex_rs1_data] [get_bd_pins RV32I_EX/ex_rs1_data]
connect_bd_net -net ex_rs2_data_1 [get_bd_pins RV32I_ID/ex_rs2_data] [get_bd_pins RV32I_EX/ex_rs2_data]
connect_bd_net -net ex_rs1_1 [get_bd_pins RV32I_ID/ex_rs1] [get_bd_pins RV32I_EX/ex_rs1]
connect_bd_net -net ex_rs2_1 [get_bd_pins RV32I_ID/ex_rs2] [get_bd_pins RV32I_EX/ex_rs2]
connect_bd_net -net ex_branch_en_1 [get_bd_pins RV32I_ID/ex_branch_en] [get_bd_pins RV32I_EX/ex_branch_en]
connect_bd_net -net ex_branch_funct3_1 [get_bd_pins RV32I_ID/ex_branch_funct3] [get_bd_pins RV32I_EX/ex_branch_funct3]
connect_bd_net -net ex_jal_1 [get_bd_pins RV32I_ID/ex_jal] [get_bd_pins RV32I_EX/ex_jal]
connect_bd_net -net ex_jalr_1 [get_bd_pins RV32I_ID/ex_jalr] [get_bd_pins RV32I_EX/ex_jalr]
connect_bd_net -net ex_imm_u_1 [get_bd_pins RV32I_ID/ex_imm_u] [get_bd_pins RV32I_EX/ex_imm_u]
connect_bd_net -net ex_valid_1 [get_bd_pins RV32I_ID/ex_valid] \
  [get_bd_pins RV32I_EX/ex_valid] [get_bd_pins ex_valid] [get_bd_pins load_use_detection_0/id_ex_valid]
connect_bd_net -net alu_op_1 [get_bd_pins RV32I_ID/ex_alu_op] [get_bd_pins RV32I_EX/alu_op]
connect_bd_net [get_bd_pins RV32I_ID/rs1] [get_bd_pins load_use_detection_0/if_id_rs1] [get_bd_pins rs1]
connect_bd_net [get_bd_pins RV32I_ID/rs2] [get_bd_pins load_use_detection_0/if_id_rs2] [get_bd_pins rs2]
connect_bd_net [get_bd_pins RV32I_ID/rs1_used] [get_bd_pins load_use_detection_0/if_id_rs1_used] [get_bd_pins rs1_used]
connect_bd_net [get_bd_pins RV32I_ID/rs2_used] [get_bd_pins load_use_detection_0/if_id_rs2_used] [get_bd_pins rs2_used]
connect_bd_net [get_bd_pins RV32I_ID/ex_pred_next_pc] [get_bd_pins RV32I_EX/ex_pred_next_pc]
connect_bd_net [get_bd_pins dmem_ready] [get_bd_pins RV32I_MEM/dmem_ready]
connect_bd_net -net Op3_1 [get_bd_pins RV32I_MEM/mem_stall_req] \
  [get_bd_pins RV32I_ID/stall] [get_bd_pins RV32I_EX/stall] [get_bd_pins mem_stall_req] [get_bd_pins RV32I_IF/stall] \
  [get_bd_pins priority_branch_OR_l_0/mem_stall_req]
connect_bd_net [get_bd_pins RV32I_ID/ex_instr] [get_bd_pins ex_instr]
connect_bd_net [get_bd_pins RV32I_ID/ex_illegal_instr] [get_bd_pins ex_illegal_instr]
connect_bd_net [get_bd_pins priv_redirect_valid] [get_bd_pins RV32I_IF/priv_redirect_valid] [get_bd_pins priority_branch_OR_l_0/priv_redirect_valid]
connect_bd_net -net rd_we1_1 [get_bd_pins rd_we] [get_bd_pins RV32I_ID/rd_we]
connect_bd_net -net rd_addr1_1 [get_bd_pins rd_addr] [get_bd_pins RV32I_ID/rd_addr]
connect_bd_net -net rd_wdata1_1 [get_bd_pins rd_wdata] [get_bd_pins RV32I_ID/rd_wdata]
connect_bd_net [get_bd_pins RV32I_MEM/wb_sel] [get_bd_pins RV32I_WB/wb_sel]
connect_bd_net [get_bd_pins RV32I_MEM/wb_data] [get_bd_pins RV32I_WB/load_data]
connect_bd_net [get_bd_pins RV32I_MEM/wb_alu_result] [get_bd_pins RV32I_WB/alu_y]
connect_bd_net [get_bd_pins RV32I_MEM/wb_pc_plus4] [get_bd_pins RV32I_WB/pc_plus4]
connect_bd_net [get_bd_pins RV32I_MEM/wb_imm_u] [get_bd_pins RV32I_WB/imm_u]
connect_bd_net [get_bd_pins RV32I_EX/out_data] [get_bd_pins out_data]
connect_bd_net -net ex_pc_plus4_1 [get_bd_pins RV32I_ID/ex_pc_plus4] [get_bd_pins RV32I_EX/ex_pc_plus4]
connect_bd_net -net Op4_1 [get_bd_pins trap_flush] [get_bd_pins RV32I_IF/trap_flush]
connect_bd_net [get_bd_pins priv_redirect_target] [get_bd_pins RV32I_IF/priv_redirect_target]
connect_bd_net [get_bd_pins RV32I_EX/bp_update_valid] [get_bd_pins RV32I_IF/update_valid]
connect_bd_net -net update_is_control_1 [get_bd_pins RV32I_EX/bp_update_is_control] [get_bd_pins RV32I_IF/update_is_control]
connect_bd_net [get_bd_pins RV32I_EX/bp_update_taken] [get_bd_pins RV32I_IF/update_taken]
connect_bd_net [get_bd_pins RV32I_EX/bp_update_target] [get_bd_pins RV32I_IF/update_target]
connect_bd_net [get_bd_pins RV32I_IF/id_pred_next_pc_out] [get_bd_pins RV32I_ID/id_pred_next_pc]
connect_bd_net [get_bd_pins RV32I_IF/id_instr_out] [get_bd_pins RV32I_ID/instr]
connect_bd_net [get_bd_pins RV32I_IF/id_pc4_out] [get_bd_pins RV32I_ID/id_pc_plus4]
connect_bd_net [get_bd_pins RV32I_IF/id_pc_out] [get_bd_pins RV32I_ID/id_pc]
connect_bd_net [get_bd_pins RV32I_EX/pc_redirect_target] [get_bd_pins RV32I_IF/pc_redirect_target]
connect_bd_net [get_bd_pins RV32I_EX/pc_redirect_valid] [get_bd_pins RV32I_IF/pc_redirect_valid]
connect_bd_net -net RV32I_MEM_mem_rd_we [get_bd_pins RV32I_MEM/mem_stage_rd_out_we] [get_bd_pins RV32I_EX/mem_stage_rd_out_we]
connect_bd_net [get_bd_pins dmem_error] [get_bd_pins RV32I_MEM/dmem_error]
connect_bd_net [get_bd_pins RV32I_MEM/regfile_we] [get_bd_pins RV32I_EX/wb_rd_we] [get_bd_pins regfile_we]
connect_bd_net [get_bd_pins RV32I_MEM/dmem_valid] [get_bd_pins dmem_valid]
connect_bd_net [get_bd_pins dmem_req_ready] [get_bd_pins RV32I_MEM/dmem_req_ready]
connect_bd_net [get_bd_pins ex_csr_rd_we] [get_bd_pins RV32I_EX/ex_csr_rd_we]
connect_bd_net [get_bd_pins ex_csr_rd_addr] [get_bd_pins RV32I_EX/ex_csr_rd_addr]
connect_bd_net [get_bd_pins ex_csr_rd_data] [get_bd_pins RV32I_EX/ex_csr_rd_data]
connect_bd_net [get_bd_pins RV32I_EX/mem_csr_rd_we] [get_bd_pins RV32I_MEM/mem_csr_rd_we]
connect_bd_net -net mem_csr_rd_addr_1 [get_bd_pins RV32I_EX/mem_csr_rd_addr] [get_bd_pins RV32I_MEM/mem_csr_rd_addr]
connect_bd_net [get_bd_pins RV32I_EX/mem_csr_rd_data] [get_bd_pins RV32I_MEM/mem_csr_rd_data]
connect_bd_net [get_bd_pins RV32I_MEM/wb_csr_rd_we] [get_bd_pins wb_csr_rd_we]
connect_bd_net [get_bd_pins RV32I_MEM/wb_csr_rd_addr] [get_bd_pins wb_csr_rd_addr]
connect_bd_net [get_bd_pins RV32I_MEM/wb_csr_rd_data] [get_bd_pins wb_csr_rd_data]
connect_bd_net [get_bd_pins RV32I_EX/mem_exception_valid] [get_bd_pins mem_exception_valid]
connect_bd_net [get_bd_pins RV32I_EX/ex_exception_valid] [get_bd_pins ex_exception_valid]
connect_bd_net [get_bd_pins RV32I_EX/ex_exception_cause] [get_bd_pins ex_exception_cause]
connect_bd_net [get_bd_pins RV32I_EX/ex_exception_tval] [get_bd_pins ex_exception_tval]
connect_bd_net [get_bd_pins RV32I_EX/mem_pc] [get_bd_pins mem_pc]
connect_bd_net [get_bd_pins RV32I_EX/mem_exception_cause] [get_bd_pins mem_exception_cause]
connect_bd_net [get_bd_pins RV32I_EX/mem_exception_tval] [get_bd_pins mem_exception_tval]
connect_bd_net [get_bd_pins RV32I_MEM/mem_fault_valid] [get_bd_pins mem_fault_valid]
connect_bd_net [get_bd_pins RV32I_MEM/mem_fault_cause] [get_bd_pins mem_fault_cause]
connect_bd_net [get_bd_pins RV32I_MEM/mem_fault_tval] [get_bd_pins mem_fault_tval]
connect_bd_net [get_bd_pins load_use_detection_0/pc_en] [get_bd_pins priority_branch_OR_l_0/load_use_pc_en]
connect_bd_net [get_bd_pins load_use_detection_0/if_id_hold] [get_bd_pins priority_branch_OR_l_0/load_use_if_id_hold]
connect_bd_net [get_bd_pins load_use_detection_0/id_ex_flush] [get_bd_pins priority_branch_OR_l_0/load_use_id_ex_flush]
connect_bd_net [get_bd_pins csr_use_pc_en] [get_bd_pins priority_branch_OR_l_0/csr_use_pc_en]
connect_bd_net [get_bd_pins csr_use_if_id_hold] [get_bd_pins priority_branch_OR_l_0/csr_use_if_id_hold]
connect_bd_net [get_bd_pins csr_use_id_ex_flush] [get_bd_pins priority_branch_OR_l_0/csr_use_id_ex_flush]
connect_bd_net -net bubble_1 [get_bd_pins priority_branch_OR_l_0/id_ex_flush_final] [get_bd_pins RV32I_ID/bubble]
connect_bd_net -net flush_1 [get_bd_pins priority_branch_OR_l_0/if_id_flush_final] [get_bd_pins RV32I_IF/flush]
connect_bd_net -net pc_en_1 [get_bd_pins priority_branch_OR_l_0/pc_en_final] [get_bd_pins RV32I_IF/pc_en]
connect_bd_net -net hold_1 [get_bd_pins priority_branch_OR_l_0/if_id_hold_final] [get_bd_pins RV32I_IF/hold]
connect_bd_net [get_bd_pins RV32I_EX/ex_flush_req] [get_bd_pins priority_branch_OR_l_0/ex_flush_req]

current_bd_instance /Core_RV32I/RV32I_MEM
connect_bd_net [get_bd_pins mem_stage_0/mem_out_alu_result] [get_bd_pins mem_wb_reg_0/mem_alu_result]
connect_bd_net [get_bd_pins mem_stage_0/mem_out_pc_plus4] [get_bd_pins mem_wb_reg_0/mem_pc_plus4]
connect_bd_net [get_bd_pins mem_stage_0/mem_out_imm_u] [get_bd_pins mem_wb_reg_0/mem_imm_u]
connect_bd_net [get_bd_pins mem_stage_0/mem_out_wb_sel] [get_bd_pins mem_wb_reg_0/mem_wb_sel]
connect_bd_net -net zynq_ultra_ps_e_0_pl_clk0 [get_bd_pins clk] [get_bd_pins mem_wb_reg_0/clk] [get_bd_pins mem_stage_0/clk]
connect_bd_net -net proc_sys_reset_0_peripheral_reset [get_bd_pins rst] [get_bd_pins mem_wb_reg_0/rst] [get_bd_pins mem_stage_0/rst]
connect_bd_net -net ex_mem_reg_1_mem_valid [get_bd_pins mem_in_valid] [get_bd_pins mem_stage_0/mem_in_valid]
connect_bd_net -net ex_mem_reg_1_mem_alu_result [get_bd_pins mem_in_alu_result] [get_bd_pins mem_stage_0/mem_in_alu_result]
connect_bd_net -net ex_mem_reg_1_mem_store_data [get_bd_pins mem_in_store_data] [get_bd_pins mem_stage_0/mem_in_store_data]
connect_bd_net -net ex_mem_reg_1_mem_pc_plus4 [get_bd_pins mem_in_pc_plus4] [get_bd_pins mem_stage_0/mem_in_pc_plus4]
connect_bd_net -net ex_mem_reg_1_mem_imm_u [get_bd_pins mem_in_imm_u] [get_bd_pins mem_stage_0/mem_in_imm_u]
connect_bd_net -net ex_mem_reg_1_mem_rd [get_bd_pins mem_in_rd] [get_bd_pins mem_stage_0/mem_in_rd]
connect_bd_net -net ex_mem_reg_1_mem_mem_re [get_bd_pins mem_in_mem_re] [get_bd_pins mem_stage_0/mem_in_mem_re]
connect_bd_net -net ex_mem_reg_1_mem_mem_size [get_bd_pins mem_in_mem_size] [get_bd_pins mem_stage_0/mem_in_mem_size]
connect_bd_net -net ex_mem_reg_1_mem_mem_unsigned [get_bd_pins mem_in_mem_unsigned] [get_bd_pins mem_stage_0/mem_in_mem_unsigned]
connect_bd_net -net ex_mem_reg_1_mem_rd_we [get_bd_pins mem_in_rd_we] [get_bd_pins mem_stage_0/mem_in_rd_we]
connect_bd_net -net ex_mem_reg_1_mem_wb_sel [get_bd_pins mem_in_wb_sel] [get_bd_pins mem_stage_0/mem_in_wb_sel]
connect_bd_net [get_bd_pins mem_stage_0/mem_out_valid] [get_bd_pins mem_stage_out_valid] [get_bd_pins mem_wb_reg_0/mem_valid]
connect_bd_net [get_bd_pins mem_stage_0/mem_out_rd] [get_bd_pins mem_rd] [get_bd_pins mem_wb_reg_0/mem_rd]
connect_bd_net [get_bd_pins mem_stage_0/mem_out_rd_we] [get_bd_pins mem_stage_rd_out_we] [get_bd_pins mem_wb_reg_0/mem_rd_we]
connect_bd_net [get_bd_pins mem_stage_0/mem_forward_data] [get_bd_pins mem_forward_data]
connect_bd_net [get_bd_pins mem_wb_reg_0/wb_data] [get_bd_pins wb_data]
connect_bd_net [get_bd_pins mem_wb_reg_0/wb_alu_result] [get_bd_pins wb_alu_result]
connect_bd_net [get_bd_pins mem_wb_reg_0/wb_pc_plus4] [get_bd_pins wb_pc_plus4]
connect_bd_net [get_bd_pins mem_wb_reg_0/wb_imm_u] [get_bd_pins wb_imm_u]
connect_bd_net [get_bd_pins mem_wb_reg_0/wb_rd] [get_bd_pins wb_rd] [get_bd_pins regfile_we_gen_0/wb_rd]
connect_bd_net [get_bd_pins mem_wb_reg_0/wb_sel] [get_bd_pins wb_sel]
connect_bd_net [get_bd_pins mem_stage_0/dmem_be] [get_bd_pins dmem_be]
connect_bd_net [get_bd_pins mem_stage_0/dmem_addr] [get_bd_pins dmem_addr]
connect_bd_net [get_bd_pins mem_stage_0/dmem_wdata] [get_bd_pins dmem_wdata]
connect_bd_net [get_bd_pins mem_stage_0/dmem_we] [get_bd_pins dmem_we]
connect_bd_net [get_bd_pins mem_stage_0/mem_out_data] [get_bd_pins mem_wb_reg_0/mem_data]
connect_bd_net [get_bd_pins mem_wb_reg_0/wb_valid] [get_bd_pins regfile_we_gen_0/wb_valid] [get_bd_pins wb_valid]
connect_bd_net [get_bd_pins mem_wb_reg_0/wb_rd_we] [get_bd_pins regfile_we_gen_0/wb_rd_we]
connect_bd_net [get_bd_pins mem_data] [get_bd_pins mem_stage_0/dmem_rdata]
connect_bd_net -net xlconstant_3_dout [get_bd_pins constant_zero_0/dout] \
  [get_bd_pins mem_wb_reg_0/stall] [get_bd_pins mem_wb_reg_0/flush] [get_bd_pins mem_stage_0/stall] \
  [get_bd_pins mem_stage_0/kill]
connect_bd_net [get_bd_pins mem_stage_0/dmem_re] [get_bd_pins dmem_re]
connect_bd_net [get_bd_pins mem_in_mem_we] [get_bd_pins mem_stage_0/mem_in_mem_we]
connect_bd_net [get_bd_pins mem_stage_0/mem_stall_req] [get_bd_pins mem_stall_req]
connect_bd_net [get_bd_pins dmem_ready] [get_bd_pins mem_stage_0/dmem_ready]
connect_bd_net [get_bd_pins dmem_error] [get_bd_pins mem_stage_0/dmem_error]
connect_bd_net [get_bd_pins regfile_we_gen_0/regfile_we] [get_bd_pins regfile_we]
connect_bd_net [get_bd_pins mem_stage_0/dmem_valid] [get_bd_pins dmem_valid]
connect_bd_net [get_bd_pins dmem_req_ready] [get_bd_pins mem_stage_0/dmem_req_ready]
connect_bd_net [get_bd_pins mem_csr_rd_we] [get_bd_pins mem_wb_reg_0/mem_csr_rd_we]
connect_bd_net [get_bd_pins mem_csr_rd_addr] [get_bd_pins mem_wb_reg_0/mem_csr_rd_addr]
connect_bd_net [get_bd_pins mem_csr_rd_data] [get_bd_pins mem_wb_reg_0/mem_csr_rd_data]
connect_bd_net [get_bd_pins mem_wb_reg_0/wb_csr_rd_we] [get_bd_pins wb_csr_rd_we]
connect_bd_net [get_bd_pins mem_wb_reg_0/wb_csr_rd_addr] [get_bd_pins wb_csr_rd_addr]
connect_bd_net [get_bd_pins mem_wb_reg_0/wb_csr_rd_data] [get_bd_pins wb_csr_rd_data]
connect_bd_net [get_bd_pins mem_stage_0/mem_fault_valid] [get_bd_pins mem_fault_valid]
connect_bd_net [get_bd_pins mem_stage_0/mem_fault_cause] [get_bd_pins mem_fault_cause]
connect_bd_net [get_bd_pins mem_stage_0/mem_fault_tval] [get_bd_pins mem_fault_tval]

current_bd_instance /Core_RV32I/RV32I_EX
connect_bd_net [get_bd_pins operand_a_mux_0/operand_a] [get_bd_pins alu_0/a]
connect_bd_net [get_bd_pins operand_b_mux_0/operand_b] [get_bd_pins alu_0/b]
connect_bd_net [get_bd_pins alu_0/y] [get_bd_pins ex_mem_reg/ex_alu_result]
connect_bd_net [get_bd_pins forward_mux_1/out_data] [get_bd_pins operand_b_mux_0/rs2_data] [get_bd_pins branch_0/ex_rs2_data]
connect_bd_net [get_bd_pins branch_0/ex_exception_valid] [get_bd_pins ex_exception_valid] [get_bd_pins ex_mem_reg/ex_exception_valid]
connect_bd_net [get_bd_pins branch_0/ex_exception_cause] [get_bd_pins ex_exception_cause] [get_bd_pins ex_mem_reg/ex_exception_cause]
connect_bd_net [get_bd_pins branch_0/ex_exception_tval] [get_bd_pins ex_exception_tval] [get_bd_pins ex_mem_reg/ex_exception_tval]
connect_bd_net [get_bd_pins forward_mux_0/out_data] [get_bd_pins operand_a_mux_0/rs1_data] [get_bd_pins out_data] [get_bd_pins branch_0/ex_rs1_data]
connect_bd_net [get_bd_pins forwarding_0/forward_a] [get_bd_pins forward_mux_0/forward_sel]
connect_bd_net [get_bd_pins forwarding_0/forward_b] [get_bd_pins forward_mux_1/forward_sel]
connect_bd_net -net id_ex_reg_0_ex_alu_op [get_bd_pins alu_op] [get_bd_pins alu_0/alu_op]
connect_bd_net -net zynq_ultra_ps_e_0_pl_clk0 [get_bd_pins clk] [get_bd_pins ex_mem_reg/clk]
connect_bd_net -net proc_sys_reset_0_peripheral_reset [get_bd_pins rst] [get_bd_pins ex_mem_reg/rst]
connect_bd_net [get_bd_pins ex_valid] [get_bd_pins branch_0/ex_valid] [get_bd_pins ex_mem_reg/ex_valid]
connect_bd_net -net id_ex_reg_0_ex_pc [get_bd_pins pc] [get_bd_pins operand_a_mux_0/pc] [get_bd_pins branch_0/ex_pc] [get_bd_pins ex_mem_reg/ex_pc]
connect_bd_net -net id_ex_reg_0_ex_pc_plus4 [get_bd_pins ex_pc_plus4] [get_bd_pins ex_mem_reg/ex_pc_plus4]
connect_bd_net -net id_ex_reg_0_ex_imm_u [get_bd_pins ex_imm_u] [get_bd_pins ex_mem_reg/ex_imm_u]
connect_bd_net -net id_ex_reg_0_ex_rd [get_bd_pins ex_rd] [get_bd_pins ex_mem_reg/ex_rd]
connect_bd_net -net id_ex_reg_0_ex_mem_re [get_bd_pins ex_mem_re] [get_bd_pins ex_mem_reg/ex_mem_re]
connect_bd_net -net id_ex_reg_0_ex_mem_size [get_bd_pins ex_mem_size] [get_bd_pins ex_mem_reg/ex_mem_size]
connect_bd_net -net id_ex_reg_0_ex_mem_unsigned [get_bd_pins ex_mem_unsigned] [get_bd_pins ex_mem_reg/ex_mem_unsigned]
connect_bd_net -net id_ex_reg_0_ex_rd_we [get_bd_pins ex_rd_we] [get_bd_pins ex_mem_reg/ex_rd_we]
connect_bd_net -net id_ex_reg_0_ex_wb_sel [get_bd_pins ex_wb_sel] [get_bd_pins ex_mem_reg/ex_wb_sel]
connect_bd_net -net ex_mem_reg_1_mem_valid [get_bd_pins ex_mem_reg/mem_valid] \
  [get_bd_pins mem_valid] [get_bd_pins util_vector_and_0/Op1] [get_bd_pins forwarding_0/mem_valid]
connect_bd_net -net ex_mem_reg_1_mem_alu_result [get_bd_pins ex_mem_reg/mem_alu_result] \
  [get_bd_pins ex_mem_data] [get_bd_pins forward_mux_0/ex_mem_data] [get_bd_pins forward_mux_1/ex_mem_data] \
  [get_bd_pins forward_mux_2/ex_mem_data]
connect_bd_net -net ex_mem_reg_1_mem_store_data [get_bd_pins ex_mem_reg/mem_store_data] [get_bd_pins mem_store_data]
connect_bd_net -net ex_mem_reg_1_mem_pc_plus4 [get_bd_pins ex_mem_reg/mem_pc_plus4] [get_bd_pins mem_pc_plus4]
connect_bd_net -net ex_mem_reg_1_mem_imm_u [get_bd_pins ex_mem_reg/mem_imm_u] [get_bd_pins mem_imm_u]
connect_bd_net -net ex_mem_reg_1_mem_rd [get_bd_pins ex_mem_reg/mem_rd] [get_bd_pins mem_rd] [get_bd_pins forwarding_0/mem_rd]
connect_bd_net -net ex_mem_reg_1_mem_mem_re [get_bd_pins ex_mem_reg/mem_mem_re] [get_bd_pins mem_mem_re] [get_bd_pins forwarding_0/mem_is_load]
connect_bd_net -net ex_mem_reg_1_mem_mem_size [get_bd_pins ex_mem_reg/mem_mem_size] [get_bd_pins mem_mem_size]
connect_bd_net -net ex_mem_reg_1_mem_mem_unsigned [get_bd_pins ex_mem_reg/mem_mem_unsigned] [get_bd_pins mem_mem_unsigned]
connect_bd_net -net ex_mem_reg_1_mem_rd_we [get_bd_pins ex_mem_reg/mem_rd_we] [get_bd_pins mem_rd_we] [get_bd_pins util_vector_and_0/Op2]
connect_bd_net -net ex_mem_reg_1_mem_wb_sel [get_bd_pins ex_mem_reg/mem_wb_sel] [get_bd_pins mem_wb_sel]
connect_bd_net -net id_ex_reg_0_ex_imm [get_bd_pins ex_imm] [get_bd_pins operand_b_mux_0/imm] [get_bd_pins branch_0/ex_imm]
connect_bd_net -net id_ex_reg_0_ex_op_b_sel [get_bd_pins ex_op_b_sel] [get_bd_pins operand_b_mux_0/op_b_sel] [get_bd_pins forwarding_0/ex_op_b_sel]
connect_bd_net -net id_ex_reg_0_ex_op_a_sel [get_bd_pins op_a_sel] [get_bd_pins operand_a_mux_0/op_a_sel]
connect_bd_net -net id_ex_reg_0_ex_rs1_data [get_bd_pins ex_rs1_data] [get_bd_pins forward_mux_0/base_data]
connect_bd_net -net mem_stage_0_mem_forward_data [get_bd_pins mem_stage_data] \
  [get_bd_pins forward_mux_0/mem_stage_data] [get_bd_pins forward_mux_1/mem_stage_data] \
  [get_bd_pins forward_mux_2/mem_stage_data]
connect_bd_net -net id_ex_reg_0_ex_rs2_data [get_bd_pins ex_rs2_data] [get_bd_pins forward_mux_1/base_data] [get_bd_pins forward_mux_2/base_data]
connect_bd_net -net id_ex_reg_0_ex_rs1 [get_bd_pins ex_rs1] [get_bd_pins forwarding_0/ex_rs1]
connect_bd_net -net id_ex_reg_0_ex_rs2 [get_bd_pins ex_rs2] [get_bd_pins forwarding_0/ex_rs2]
connect_bd_net -net mem_stage_0_mem_out_rd [get_bd_pins mem_stage_rd] [get_bd_pins forwarding_0/mem_stage_rd]
connect_bd_net -net mem_wb_reg_0_wb_rd [get_bd_pins wb_rd] [get_bd_pins forwarding_0/wb_rd]
connect_bd_net -net id_ex_reg_0_ex_branch_en [get_bd_pins ex_branch_en] [get_bd_pins branch_0/ex_branch_en]
connect_bd_net -net id_ex_reg_0_ex_branch_funct3 [get_bd_pins ex_branch_funct3] [get_bd_pins branch_0/ex_branch_funct3]
connect_bd_net -net id_ex_reg_0_ex_jal [get_bd_pins ex_jal] [get_bd_pins branch_0/ex_jal]
connect_bd_net -net id_ex_reg_0_ex_jalr [get_bd_pins ex_jalr] [get_bd_pins branch_0/ex_jalr]
connect_bd_net [get_bd_pins branch_0/pc_redirect_valid] [get_bd_pins pc_redirect_valid]
connect_bd_net [get_bd_pins branch_0/pc_redirect_target] [get_bd_pins pc_redirect_target]
connect_bd_net [get_bd_pins branch_0/ex_flush_req] [get_bd_pins ex_flush_req]
connect_bd_net -net wb_mux_0_rd_wdata [get_bd_pins mem_wb_data] \
  [get_bd_pins forward_mux_0/mem_wb_data] [get_bd_pins forward_mux_1/mem_wb_data] [get_bd_pins forward_mux_2/mem_wb_data]
connect_bd_net [get_bd_pins forwarding_0/forward_store] [get_bd_pins forward_mux_2/forward_sel]
connect_bd_net [get_bd_pins forward_mux_2/out_data] [get_bd_pins ex_mem_reg/ex_store_data]
connect_bd_net -net mem_stage_valid_1 [get_bd_pins mem_stage_out_valid] [get_bd_pins util_vector_and_1/Op1] [get_bd_pins forwarding_0/mem_stage_valid]
connect_bd_net [get_bd_pins wb_valid] [get_bd_pins forwarding_0/wb_valid]
connect_bd_net -net id_ex_reg_0_ex_mem_we [get_bd_pins ex_mem_we] [get_bd_pins ex_mem_reg/ex_mem_we]
connect_bd_net -net ex_mem_reg_1_mem_mem_we [get_bd_pins ex_mem_reg/mem_mem_we] [get_bd_pins mem_mem_we]
connect_bd_net [get_bd_pins ex_pred_next_pc] [get_bd_pins branch_0/ex_pred_next_pc]
connect_bd_net [get_bd_pins branch_0/bp_update_target] [get_bd_pins bp_update_target]
connect_bd_net [get_bd_pins branch_0/bp_update_taken] [get_bd_pins bp_update_taken]
connect_bd_net [get_bd_pins branch_0/bp_update_is_control] [get_bd_pins bp_update_is_control]
connect_bd_net [get_bd_pins branch_0/bp_update_valid] [get_bd_pins bp_update_valid]
connect_bd_net [get_bd_pins branch_0/ex_actual_next_pc] [get_bd_pins ex_actual_next_pc]
connect_bd_net [get_bd_pins stall] [get_bd_pins ex_mem_reg/stall]
connect_bd_net -net Op2_1 [get_bd_pins mem_stage_rd_out_we] [get_bd_pins util_vector_and_1/Op2]
connect_bd_net -net wb_rd_we1_1 [get_bd_pins wb_rd_we] [get_bd_pins forwarding_0/wb_rd_we]
connect_bd_net [get_bd_pins ex_csr_rd_we] [get_bd_pins ex_mem_reg/ex_csr_rd_we]
connect_bd_net [get_bd_pins ex_csr_rd_addr] [get_bd_pins ex_mem_reg/ex_csr_rd_addr]
connect_bd_net [get_bd_pins ex_csr_rd_data] [get_bd_pins ex_mem_reg/ex_csr_rd_data]
connect_bd_net [get_bd_pins ex_mem_reg/mem_csr_rd_we] [get_bd_pins mem_csr_rd_we]
connect_bd_net [get_bd_pins ex_mem_reg/mem_csr_rd_addr] [get_bd_pins mem_csr_rd_addr]
connect_bd_net [get_bd_pins ex_mem_reg/mem_csr_rd_data] [get_bd_pins mem_csr_rd_data]
connect_bd_net [get_bd_pins ex_mem_reg/mem_exception_valid] [get_bd_pins mem_exception_valid]
connect_bd_net [get_bd_pins ex_mem_reg/mem_pc] [get_bd_pins mem_pc]
connect_bd_net [get_bd_pins ex_mem_reg/mem_exception_cause] [get_bd_pins mem_exception_cause]
connect_bd_net [get_bd_pins ex_mem_reg/mem_exception_tval] [get_bd_pins mem_exception_tval]
connect_bd_net [get_bd_pins util_vector_and_1/Res] [get_bd_pins forwarding_0/mem_stage_rd_we]
connect_bd_net [get_bd_pins util_vector_and_0/Res] [get_bd_pins forwarding_0/mem_rd_we]
connect_bd_net [get_bd_pins constant_zero_0/dout] [get_bd_pins ex_mem_reg/flush]
